# Altium schematic sheet Mjollnir.SchDoc (part 1 of 2)
size A0 portrait; SheetNumber: 1; SheetTotal: 1
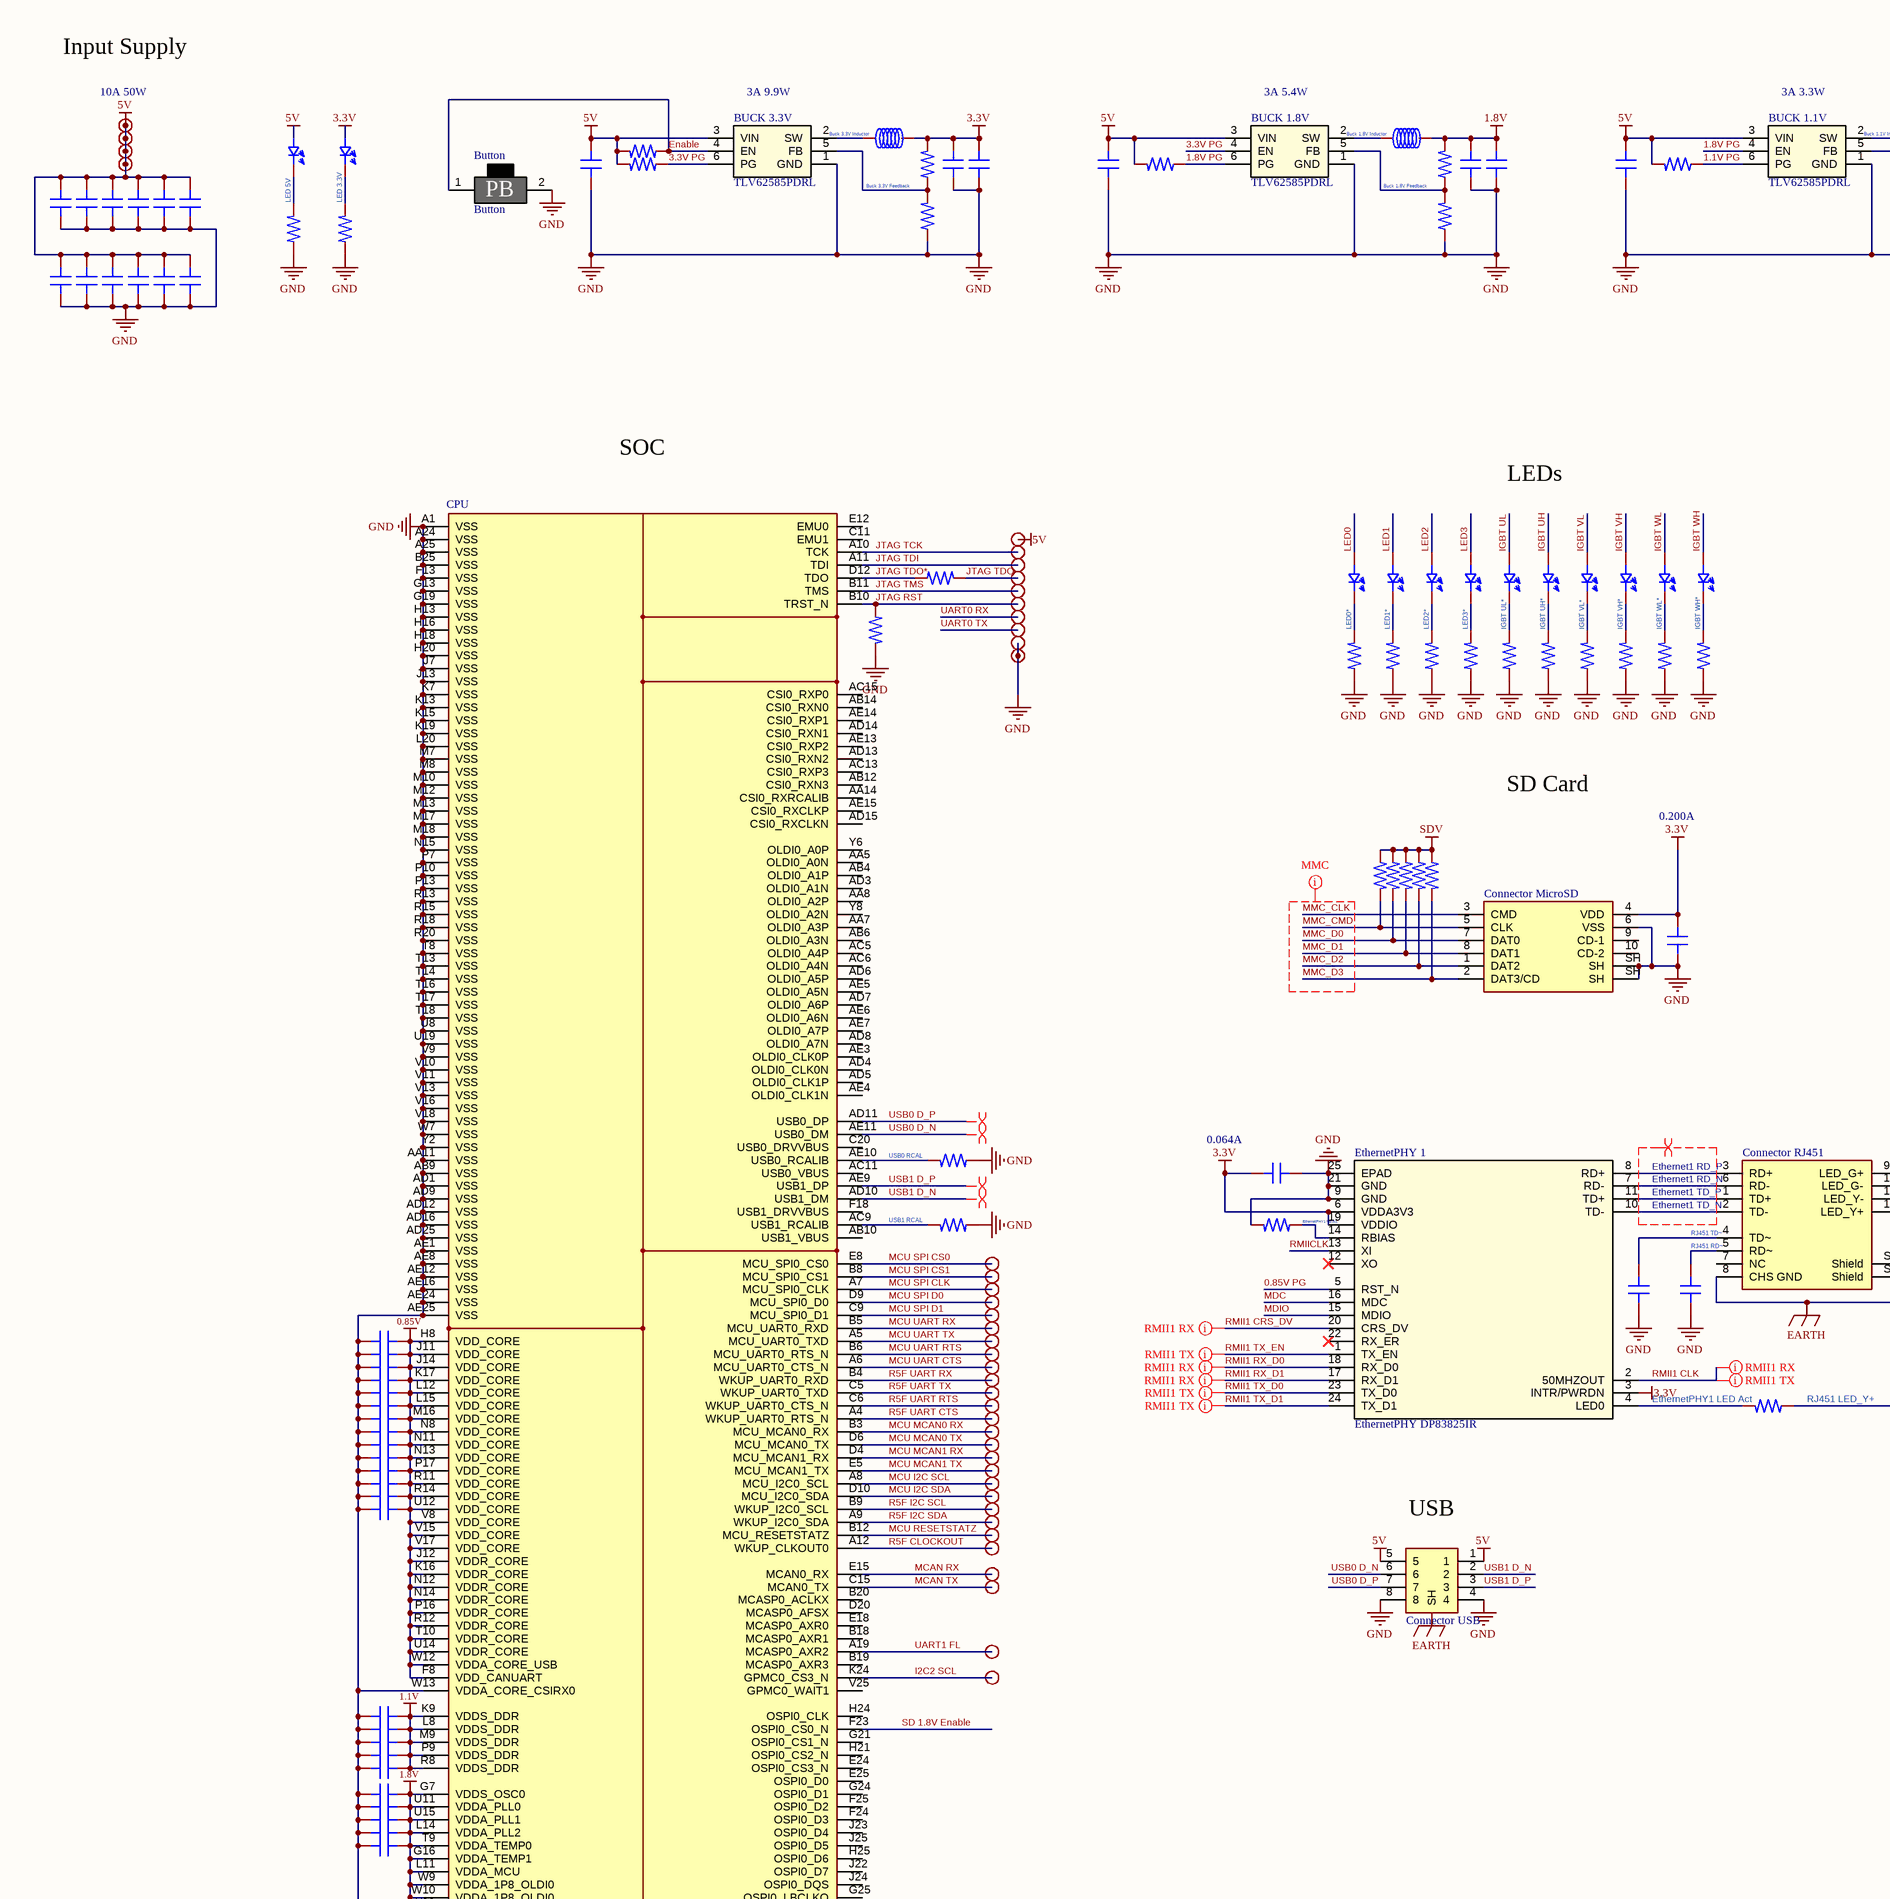
[diagram p0: Mjollnir.SchDoc, top left]
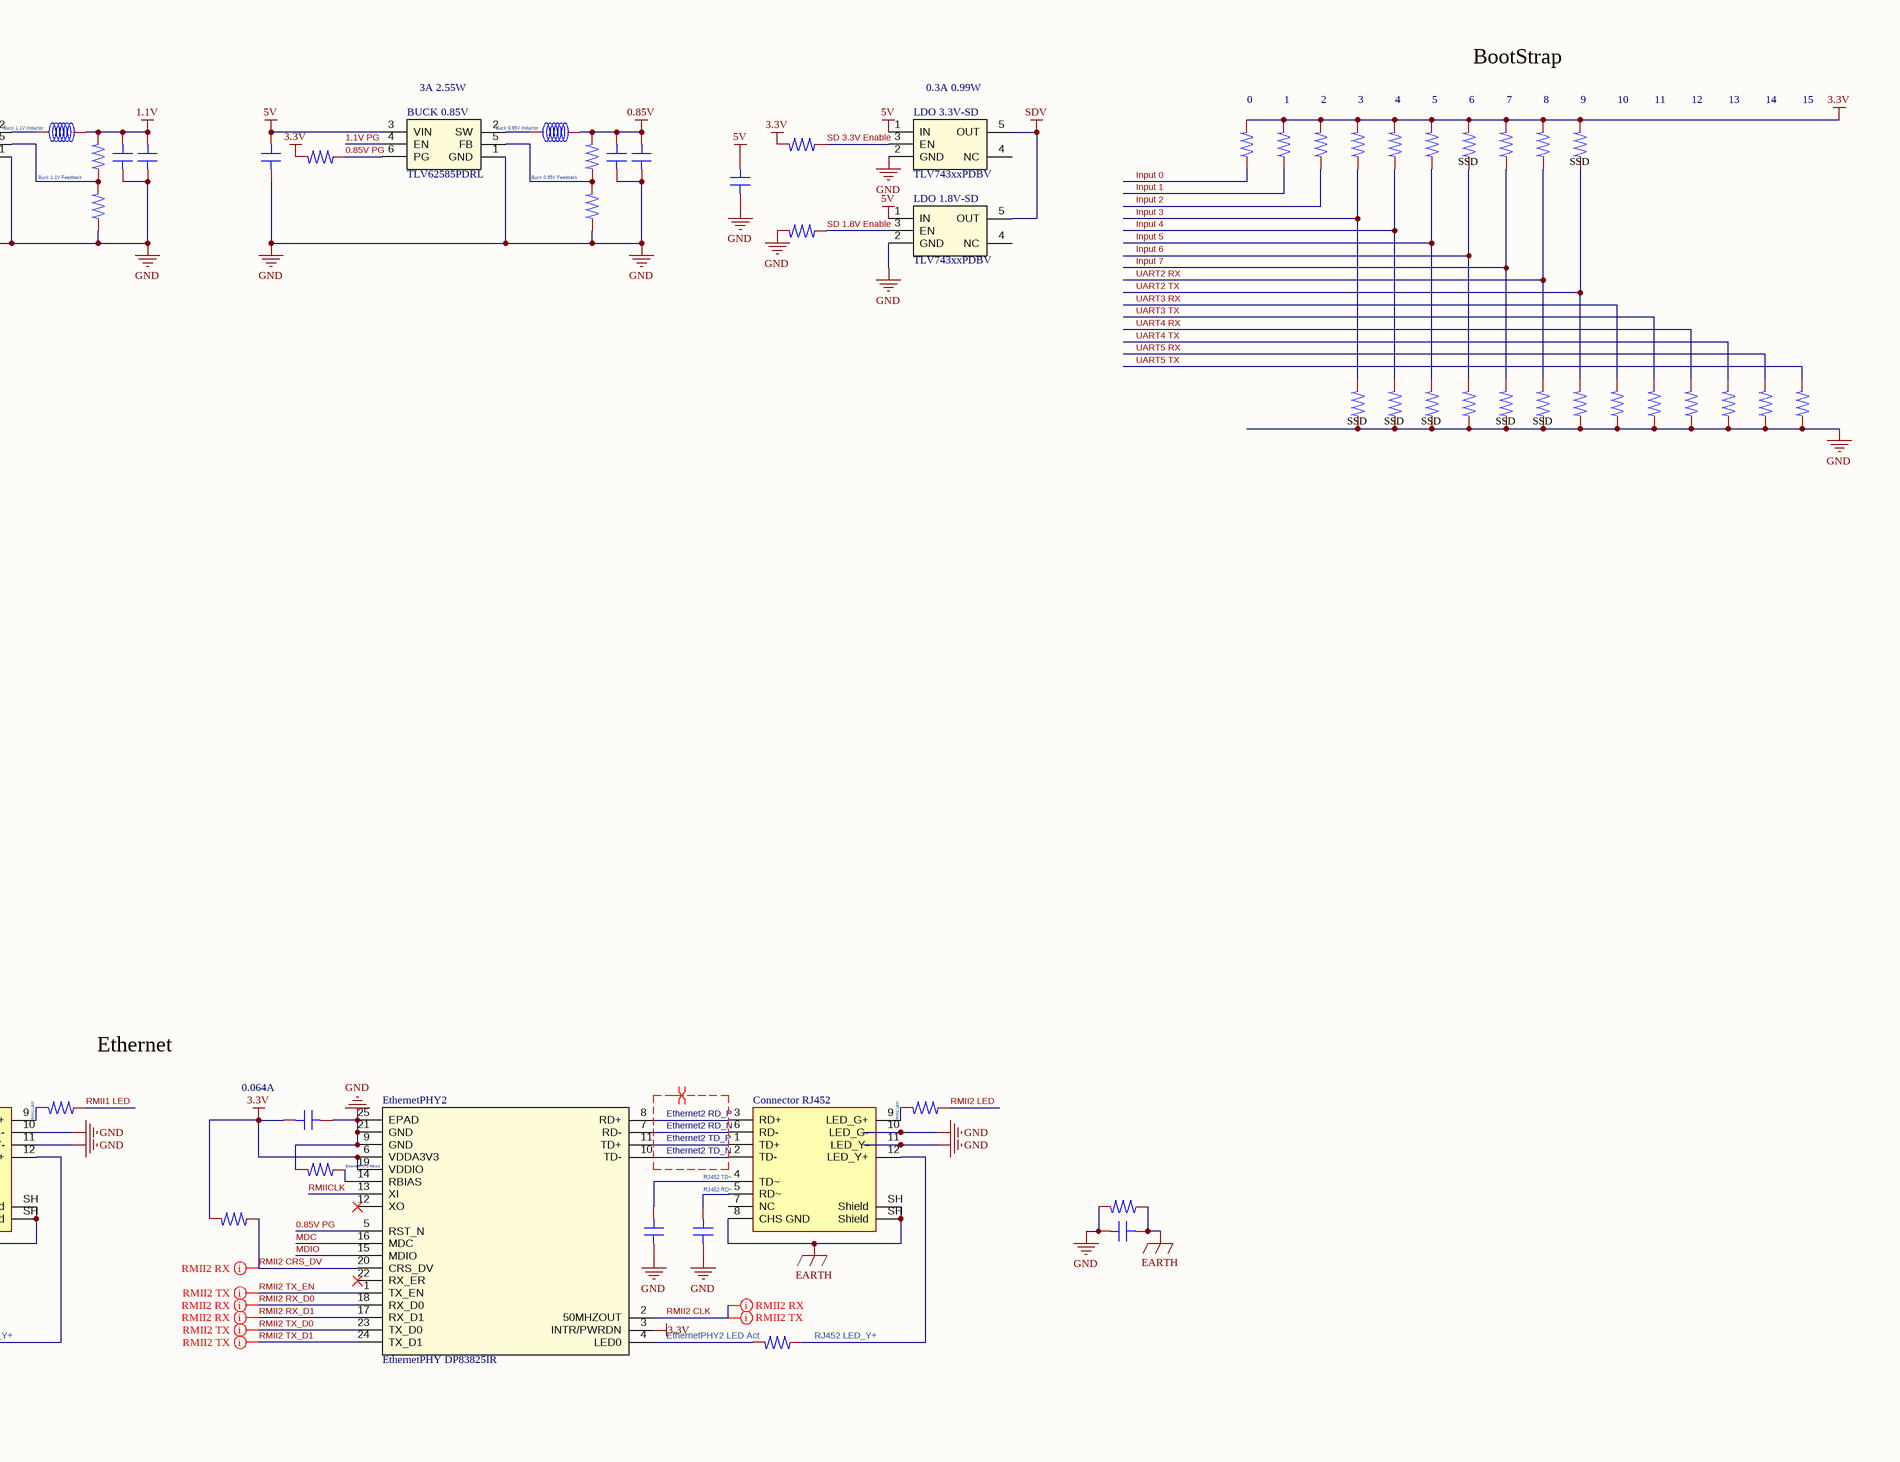
[diagram p1: Mjollnir.SchDoc, top right]
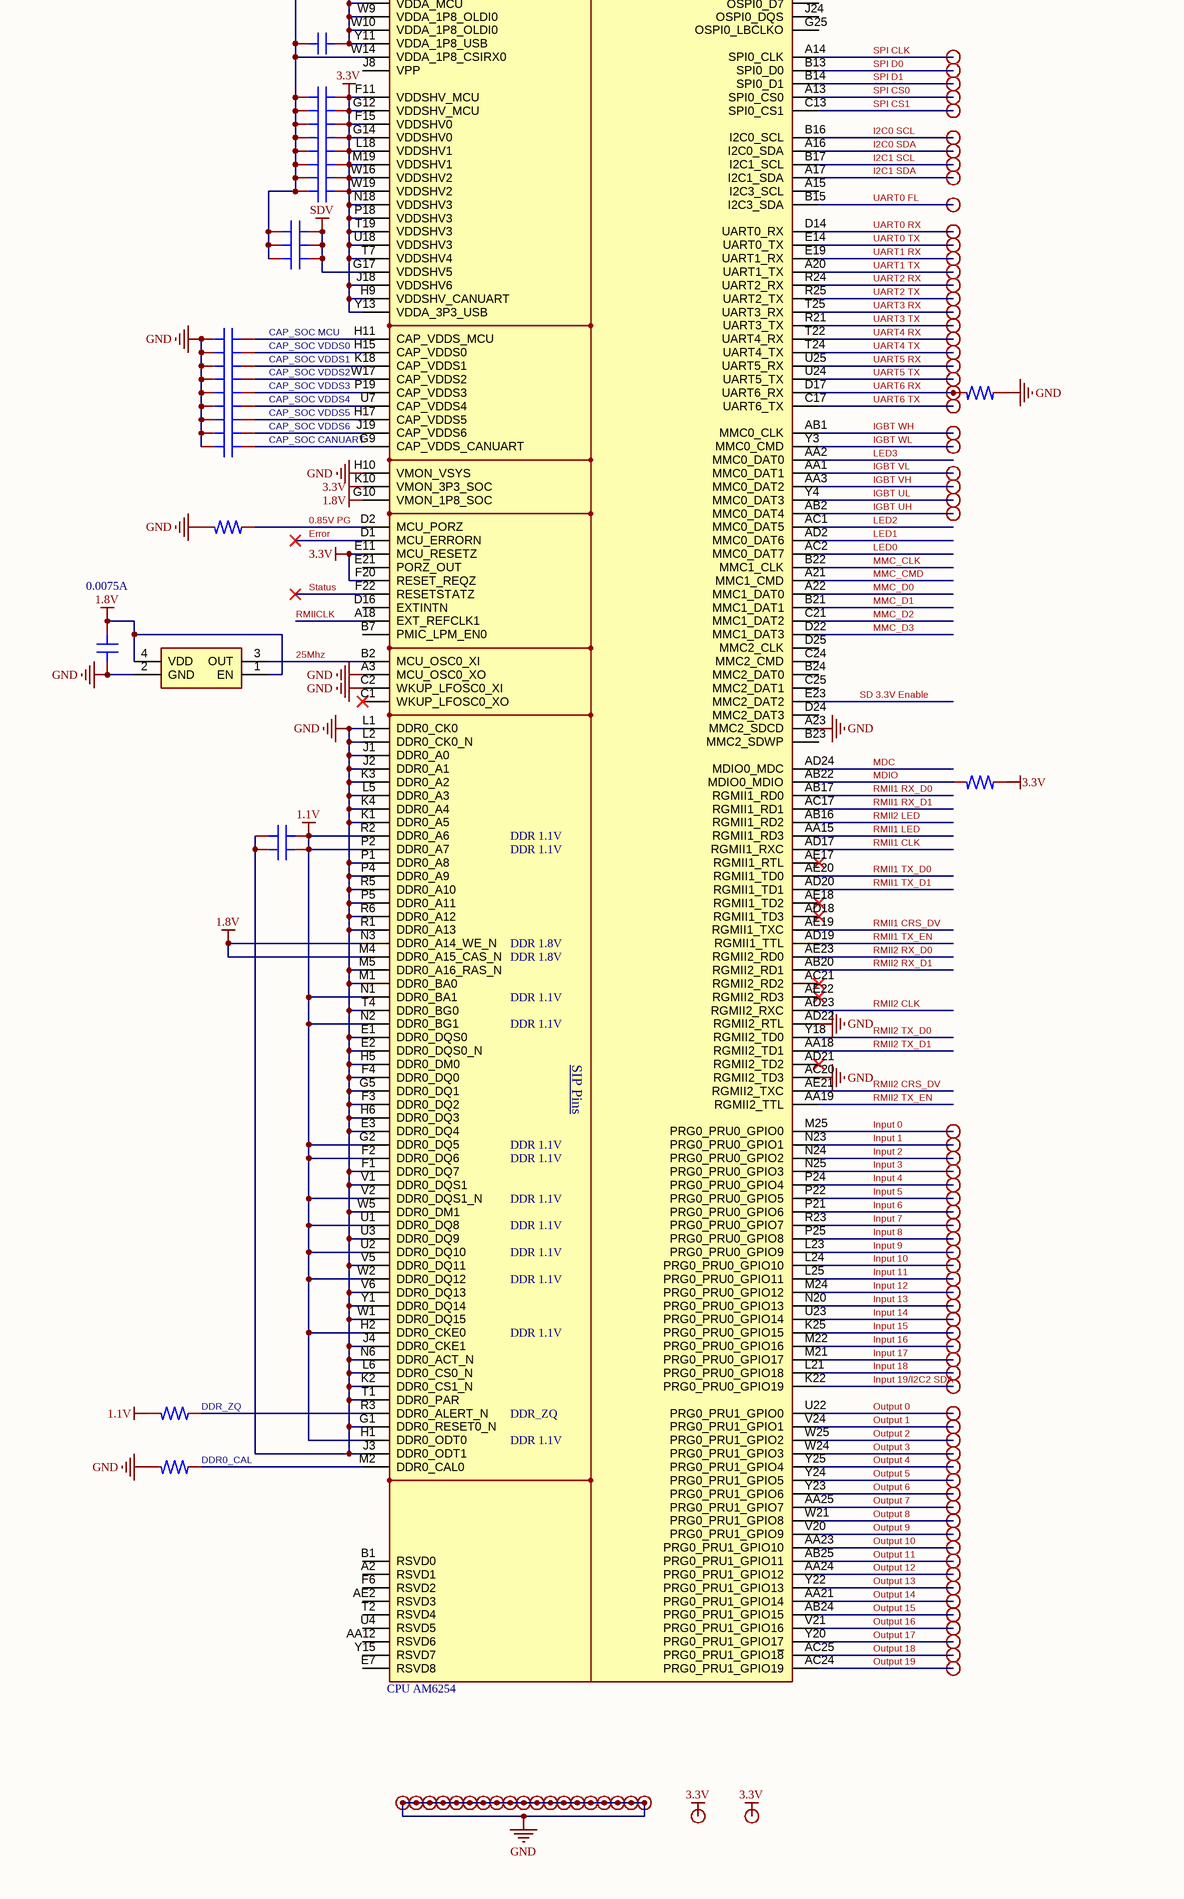
[diagram p2: Mjollnir.SchDoc, bottom left]

## Parts
BUCK_0.85V  TLV62585PDRL  [TPS62A03ADLR]
BUCK_1.1V  TLV62585PDRL  [TPS62A03ADLR]
BUCK_1.8V  TLV62585PDRL  [TPS62A03ADLR]
BUCK_3.3V  TLV62585PDRL  [TPS62A03ADLR]
Button  Button  [PushButton TSB008A25]
C_1.8V_Crystal  1uF  [Capacitor 2012(0805)]  (value not drawn)
C_AM62x_0.85V-1  0.1uF  [Capacitor 1005(0402)]  (value not drawn)
C_AM62x_0.85V-2  0.1uF  [Capacitor 1005(0402)]  (value not drawn)
C_AM62x_0.85V-3  0.1uF  [Capacitor 1005(0402)]  (value not drawn)
C_AM62x_0.85V-4  0.1uF  [Capacitor 1005(0402)]  (value not drawn)
C_AM62x_0.85V-5  0.1uF  [Capacitor 1005(0402)]  (value not drawn)
C_AM62x_0.85V-6  0.1uF  [Capacitor 1005(0402)]  (value not drawn)
C_AM62x_0.85V-7  0.1uF  [Capacitor 1005(0402)]  (value not drawn)
C_AM62x_0.85V-8  0.1uF  [Capacitor 1005(0402)]  (value not drawn)
C_AM62x_0.85V-9  0.1uF  [Capacitor 1005(0402)]  (value not drawn)
C_AM62x_0.85V-10  0.1uF  [Capacitor 1005(0402)]  (value not drawn)
C_AM62x_0.85V-11  0.1uF  [Capacitor 1005(0402)]  (value not drawn)
C_AM62x_0.85V-12  0.1uF  [Capacitor 1005(0402)]  (value not drawn)
C_AM62x_0.85V-13  0.1uF  [Capacitor 1005(0402)]  (value not drawn)
C_AM62x_0.85V-14  0.1uF  [Capacitor 1005(0402)]  (value not drawn)
C_AM62x_1.1V-1  0.1uF  [Capacitor 1005(0402)]  (value not drawn)
C_AM62x_1.1V-2  0.1uF  [Capacitor 1005(0402)]  (value not drawn)
C_AM62x_1.1V-3  0.1uF  [Capacitor 1005(0402)]  (value not drawn)
C_AM62x_1.1V-4  0.1uF  [Capacitor 1005(0402)]  (value not drawn)
C_AM62x_1.1V-5  0.1uF  [Capacitor 1005(0402)]  (value not drawn)
C_AM62x_1.1V-6  0.1uF  [Capacitor 1005(0402)]  (value not drawn)
C_AM62x_1.1V-7  0.1uF  [Capacitor 1005(0402)]  (value not drawn)
C_AM62x_1.8V-1  0.1uF  [Capacitor 1005(0402)]  (value not drawn)
C_AM62x_1.8V-2  0.1uF  [Capacitor 1005(0402)]  (value not drawn)
C_AM62x_1.8V-3  0.1uF  [Capacitor 1005(0402)]  (value not drawn)
C_AM62x_1.8V-4  0.1uF  [Capacitor 1005(0402)]  (value not drawn)
C_AM62x_1.8V-5  0.1uF  [Capacitor 1005(0402)]  (value not drawn)
C_AM62x_1.8V-10  0.1uF  [Capacitor 1005(0402)]  (value not drawn)
C_AM62x_3.3V-1  0.1uF  [Capacitor 1005(0402)]  (value not drawn)
C_AM62x_3.3V-2  0.1uF  [Capacitor 1005(0402)]  (value not drawn)
C_AM62x_3.3V-3  0.1uF  [Capacitor 1005(0402)]  (value not drawn)
C_AM62x_3.3V-4  0.1uF  [Capacitor 1005(0402)]  (value not drawn)
C_AM62x_3.3V-5  0.1uF  [Capacitor 1005(0402)]  (value not drawn)
C_AM62x_3.3V-6  0.1uF  [Capacitor 1005(0402)]  (value not drawn)
C_AM62x_3.3V-7  0.1uF  [Capacitor 1005(0402)]  (value not drawn)
C_AM62x_3.3V-8  0.1uF  [Capacitor 1005(0402)]  (value not drawn)
C_AM62x_SDV_0.1uF  0.1uF  [Capacitor 1005(0402)]  (value not drawn)
C_AM62x_SDV_1uF  1uF  [Capacitor 2012(0805)]  (value not drawn)
C_AM62x_SDV_10uF  10uF  [Capacitor 2012(0805)]  (value not drawn)
C_Backup-1  22uF  [Capacitor 2012(0805)]  (value not drawn)
C_Backup-2  22uF  [Capacitor 2012(0805)]  (value not drawn)
C_Backup-3  22uF  [Capacitor 2012(0805)]  (value not drawn)
C_Backup-4  22uF  [Capacitor 2012(0805)]  (value not drawn)
C_Backup-5  22uF  [Capacitor 2012(0805)]  (value not drawn)
C_Backup-6  22uF  [Capacitor 2012(0805)]  (value not drawn)
C_Backup-7  22uF  [Capacitor 2012(0805)]  (value not drawn)
C_Backup-8  22uF  [Capacitor 2012(0805)]  (value not drawn)
C_Backup-9  22uF  [Capacitor 2012(0805)]  (value not drawn)
C_Backup-10  22uF  [Capacitor 2012(0805)]  (value not drawn)
C_Backup-11  22uF  [Capacitor 2012(0805)]  (value not drawn)
C_Backup-12  22uF  [Capacitor 2012(0805)]  (value not drawn)
C_BUCK-0.85V-IN  22uF  [Capacitor 2012(0805)]  (value not drawn)
C_BUCK-0.85V-OUT1  22uF  [Capacitor 2012(0805)]  (value not drawn)
C_BUCK-0.85V-OUT2  22uF  [Capacitor 2012(0805)]  (value not drawn)
C_BUCK-1.1V-IN  22uF  [Capacitor 2012(0805)]  (value not drawn)
C_BUCK-1.1V-OUT1  22uF  [Capacitor 2012(0805)]  (value not drawn)
C_BUCK-1.1V-OUT2  22uF  [Capacitor 2012(0805)]  (value not drawn)
C_BUCK-1.8V-IN  22uF  [Capacitor 2012(0805)]  (value not drawn)
C_BUCK-1.8V-OUT1  22uF  [Capacitor 2012(0805)]  (value not drawn)
C_BUCK-1.8V-OUT2  22uF  [Capacitor 2012(0805)]  (value not drawn)
C_BUCK-3.3V-IN  22uF  [Capacitor 2012(0805)]  (value not drawn)
C_BUCK-3.3V-OUT1  22uF  [Capacitor 2012(0805)]  (value not drawn)
C_BUCK-3.3V-OUT2  22uF  [Capacitor 2012(0805)]  (value not drawn)
C_CAP_SOC_MCU  1uF  [Capacitor 1005(0402)]  (value not drawn)
C_CAP_SOC_VDDS0  1uF  [Capacitor 1005(0402)]  (value not drawn)
C_CAP_SOC_VDDS1  1uF  [Capacitor 1005(0402)]  (value not drawn)
C_CAP_SOC_VDDS2  1uF  [Capacitor 1005(0402)]  (value not drawn)
C_CAP_SOC_VDDS3  1uF  [Capacitor 1005(0402)]  (value not drawn)
C_CAP_SOC_VDDS4  1uF  [Capacitor 1005(0402)]  (value not drawn)
C_CAP_SOC_VDDS5  1uF  [Capacitor 1005(0402)]  (value not drawn)
C_CAP_SOC_VDDS6  1uF  [Capacitor 1005(0402)]  (value not drawn)
C_CAP_SOC_VDDS_CANUART  1uF  [Capacitor 1005(0402)]  (value not drawn)
C_EthernetPHY1-1  22uF  [Capacitor 2012(0805)]  (value not drawn)
C_EthernetPHY2-1  22uF  [Capacitor 2012(0805)]  (value not drawn)
C_EthernetPHY_Earth  0.1uF  [Capacitor 2012(0805)]  (value not drawn)
C_LDO_SDV-IN  0.1uF  [Capacitor 2012(0805)]  (value not drawn)
C_MMC-1  0.1uF  [Capacitor 2012(0805)]  (value not drawn)
C_RJ451_RD1  1uF  [Capacitor 2012(0805)]  (value not drawn)
C_RJ451_TD1  1uF  [Capacitor 2012(0805)]  (value not drawn)
C_RJ452_RD1  1uF  [Capacitor 2012(0805)]  (value not drawn)
C_RJ452_TD1  1uF  [Capacitor 2012(0805)]  (value not drawn)
Connector_3.3V_Aux-1  Connector BergStrip  [BergStrip 2.54mm]  (value not drawn)
Connector_3.3V_Aux-2  Connector BergStrip  [BergStrip 2.54mm]  (value not drawn)
Connector_5V-1  Connector BergStrip  [BergStrip 2.54mm]  (value not drawn)
Connector_5V-2  Connector BergStrip  [BergStrip 2.54mm]  (value not drawn)
Connector_5V-3  Connector BergStrip  [BergStrip 2.54mm]  (value not drawn)
Connector_5V-4  Connector BergStrip  [BergStrip 2.54mm]  (value not drawn)
Connector_GND1  Connector BergStrip  [BergStrip 2.54mm]  (value not drawn)
Connector_GND2  Connector BergStrip  [BergStrip 2.54mm]  (value not drawn)
Connector_GND3  Connector BergStrip  [BergStrip 2.54mm]  (value not drawn)
Connector_GND4  Connector BergStrip  [BergStrip 2.54mm]  (value not drawn)
Connector_GND5  Connector BergStrip  [BergStrip 2.54mm]  (value not drawn)
Connector_GND6  Connector BergStrip  [BergStrip 2.54mm]  (value not drawn)
Connector_GND7  Connector BergStrip  [BergStrip 2.54mm]  (value not drawn)
Connector_GND8  Connector BergStrip  [BergStrip 2.54mm]  (value not drawn)
Connector_GND9  Connector BergStrip  [BergStrip 2.54mm]  (value not drawn)
Connector_GND11  Connector BergStrip  [BergStrip 2.54mm]  (value not drawn)
Connector_GND12  Connector BergStrip  [BergStrip 2.54mm]  (value not drawn)
Connector_GND13  Connector BergStrip  [BergStrip 2.54mm]  (value not drawn)
Connector_GND14  Connector BergStrip  [BergStrip 2.54mm]  (value not drawn)
Connector_GND15  Connector BergStrip  [BergStrip 2.54mm]  (value not drawn)
Connector_GND16  Connector BergStrip  [BergStrip 2.54mm]  (value not drawn)
Connector_GND17  Connector BergStrip  [BergStrip 2.54mm]  (value not drawn)
Connector_GND18  Connector BergStrip  [BergStrip 2.54mm]  (value not drawn)
Connector_GND19  Connector BergStrip  [BergStrip 2.54mm]  (value not drawn)
Connector_GND20  Connector BergStrip  [BergStrip 2.54mm]  (value not drawn)
Connector_I2C0_SCL  Connector BergStrip  [BergStrip 2.54mm]  (value not drawn)
Connector_I2C0_SDA  Connector BergStrip  [BergStrip 2.54mm]  (value not drawn)
Connector_I2C1_SCL  Connector BergStrip  [BergStrip 2.54mm]  (value not drawn)
Connector_I2C1_SDA  Connector BergStrip  [BergStrip 2.54mm]  (value not drawn)
Connector_I2C2_SDA  Connector BergStrip  [BergStrip 2.54mm]  (value not drawn)
Connector_IGBT_UH  Connector BergStrip  [BergStrip 2.54mm]  (value not drawn)
Connector_IGBT_UL  Connector BergStrip  [BergStrip 2.54mm]  (value not drawn)
Connector_IGBT_VH  Connector BergStrip  [BergStrip 2.54mm]  (value not drawn)
Connector_IGBT_VL  Connector BergStrip  [BergStrip 2.54mm]  (value not drawn)
Connector_IGBT_WH  Connector BergStrip  [BergStrip 2.54mm]  (value not drawn)
Connector_IGBT_WL  Connector BergStrip  [BergStrip 2.54mm]  (value not drawn)
Connector_JTAG_5V  Connector BergStrip  [BergStrip 2.54mm]  (value not drawn)
Connector_JTAG_GND-1  Connector BergStrip  [BergStrip 2.54mm]  (value not drawn)
Connector_JTAG_GND-2  Connector BergStrip  [BergStrip 2.54mm]  (value not drawn)
Connector_JTAG_RST  Connector BergStrip  [BergStrip 2.54mm]  (value not drawn)
Connector_JTAG_TCK  Connector BergStrip  [BergStrip 2.54mm]  (value not drawn)
Connector_JTAG_TDI  Connector BergStrip  [BergStrip 2.54mm]  (value not drawn)
Connector_JTAG_TDO  Connector BergStrip  [BergStrip 2.54mm]  (value not drawn)
Connector_JTAG_TMS  Connector BergStrip  [BergStrip 2.54mm]  (value not drawn)
Connector_JTAG_TX  Connector BergStrip  [BergStrip 2.54mm]  (value not drawn)
Connector_JTAG_UART_RX  Connector BergStrip  [BergStrip 2.54mm]  (value not drawn)
Connector_MCAN_RX  Connector BergStrip  [BergStrip 2.54mm]  (value not drawn)
Connector_MCAN_TX  Connector BergStrip  [BergStrip 2.54mm]  (value not drawn)
Connector_MCU_I2C_SCL  Connector BergStrip  [BergStrip 2.54mm]  (value not drawn)
Connector_MCU_I2C_SDA  Connector BergStrip  [BergStrip 2.54mm]  (value not drawn)
Connector_MCU_MCAN0_RX  Connector BergStrip  [BergStrip 2.54mm]  (value not drawn)
Connector_MCU_MCAN0_TX  Connector BergStrip  [BergStrip 2.54mm]  (value not drawn)
Connector_MCU_MCAN1_RX  Connector BergStrip  [BergStrip 2.54mm]  (value not drawn)
Connector_MCU_MCAN1_TX  Connector BergStrip  [BergStrip 2.54mm]  (value not drawn)
Connector_MCU_RESETSTATZ  Connector BergStrip  [BergStrip 2.54mm]  (value not drawn)
Connector_MCU_SPI_CLK  Connector BergStrip  [BergStrip 2.54mm]  (value not drawn)
Connector_MCU_SPI_CS0  Connector BergStrip  [BergStrip 2.54mm]  (value not drawn)
Connector_MCU_SPI_CS1  Connector BergStrip  [BergStrip 2.54mm]  (value not drawn)
Connector_MCU_SPI_D0  Connector BergStrip  [BergStrip 2.54mm]  (value not drawn)
Connector_MCU_SPI_D1  Connector BergStrip  [BergStrip 2.54mm]  (value not drawn)
Connector_MCU_UART_CTS  Connector BergStrip  [BergStrip 2.54mm]  (value not drawn)
Connector_MCU_UART_RTS  Connector BergStrip  [BergStrip 2.54mm]  (value not drawn)
Connector_MCU_UART_RX  Connector BergStrip  [BergStrip 2.54mm]  (value not drawn)
Connector_MCU_UART_TX  Connector BergStrip  [BergStrip 2.54mm]  (value not drawn)
Connector_MicroSD  Connector MicroSD  [MicroSD SameSky MSD-11-A]  (value not drawn)
Connector_PRU0_GPIO0  Connector BergStrip  [BergStrip 2.54mm]  (value not drawn)
Connector_PRU0_GPIO1  Connector BergStrip  [BergStrip 2.54mm]  (value not drawn)
Connector_PRU0_GPIO2  Connector BergStrip  [BergStrip 2.54mm]  (value not drawn)
Connector_PRU0_GPIO3  Connector BergStrip  [BergStrip 2.54mm]  (value not drawn)
Connector_PRU0_GPIO4  Connector BergStrip  [BergStrip 2.54mm]  (value not drawn)
Connector_PRU0_GPIO5  Connector BergStrip  [BergStrip 2.54mm]  (value not drawn)
Connector_PRU0_GPIO6  Connector BergStrip  [BergStrip 2.54mm]  (value not drawn)
Connector_PRU0_GPIO7  Connector BergStrip  [BergStrip 2.54mm]  (value not drawn)
Connector_PRU0_GPIO8  Connector BergStrip  [BergStrip 2.54mm]  (value not drawn)
Connector_PRU0_GPIO9  Connector BergStrip  [BergStrip 2.54mm]  (value not drawn)
Connector_PRU0_GPIO10  Connector BergStrip  [BergStrip 2.54mm]  (value not drawn)
Connector_PRU0_GPIO11  Connector BergStrip  [BergStrip 2.54mm]  (value not drawn)
Connector_PRU0_GPIO12  Connector BergStrip  [BergStrip 2.54mm]  (value not drawn)
Connector_PRU0_GPIO13  Connector BergStrip  [BergStrip 2.54mm]  (value not drawn)
Connector_PRU0_GPIO14  Connector BergStrip  [BergStrip 2.54mm]  (value not drawn)
Connector_PRU0_GPIO15  Connector BergStrip  [BergStrip 2.54mm]  (value not drawn)
Connector_PRU0_GPIO16  Connector BergStrip  [BergStrip 2.54mm]  (value not drawn)
Connector_PRU0_GPIO17  Connector BergStrip  [BergStrip 2.54mm]  (value not drawn)
Connector_PRU0_GPIO18  Connector BergStrip  [BergStrip 2.54mm]  (value not drawn)
Connector_PRU0_GPIO19  Connector BergStrip  [BergStrip 2.54mm]  (value not drawn)
Connector_PRU1_GPIO0  Connector BergStrip  [BergStrip 2.54mm]  (value not drawn)
Connector_PRU1_GPIO1  Connector BergStrip  [BergStrip 2.54mm]  (value not drawn)
Connector_PRU1_GPIO2  Connector BergStrip  [BergStrip 2.54mm]  (value not drawn)
Connector_PRU1_GPIO3  Connector BergStrip  [BergStrip 2.54mm]  (value not drawn)
Connector_PRU1_GPIO4  Connector BergStrip  [BergStrip 2.54mm]  (value not drawn)
Connector_PRU1_GPIO5  Connector BergStrip  [BergStrip 2.54mm]  (value not drawn)
Connector_PRU1_GPIO6  Connector BergStrip  [BergStrip 2.54mm]  (value not drawn)
Connector_PRU1_GPIO7  Connector BergStrip  [BergStrip 2.54mm]  (value not drawn)
Connector_PRU1_GPIO8  Connector BergStrip  [BergStrip 2.54mm]  (value not drawn)
Connector_PRU1_GPIO9  Connector BergStrip  [BergStrip 2.54mm]  (value not drawn)
Connector_PRU1_GPIO10  Connector BergStrip  [BergStrip 2.54mm]  (value not drawn)
Connector_PRU1_GPIO11  Connector BergStrip  [BergStrip 2.54mm]  (value not drawn)
Connector_PRU1_GPIO12  Connector BergStrip  [BergStrip 2.54mm]  (value not drawn)
Connector_PRU1_GPIO13  Connector BergStrip  [BergStrip 2.54mm]  (value not drawn)
Connector_PRU1_GPIO14  Connector BergStrip  [BergStrip 2.54mm]  (value not drawn)
Connector_PRU1_GPIO15  Connector BergStrip  [BergStrip 2.54mm]  (value not drawn)
Connector_PRU1_GPIO16  Connector BergStrip  [BergStrip 2.54mm]  (value not drawn)
Connector_PRU1_GPIO17  Connector BergStrip  [BergStrip 2.54mm]  (value not drawn)
Connector_PRU1_GPIO18  Connector BergStrip  [BergStrip 2.54mm]  (value not drawn)
Connector_PRU1_GPIO19  Connector BergStrip  [BergStrip 2.54mm]  (value not drawn)
Connector_R5F_CLOCKOUT  Connector BergStrip  [BergStrip 2.54mm]  (value not drawn)
Connector_R5F_I2C_SCL  Connector BergStrip  [BergStrip 2.54mm]  (value not drawn)
Connector_R5F_I2C_SDA  Connector BergStrip  [BergStrip 2.54mm]  (value not drawn)
Connector_R5F_UART_CTS  Connector BergStrip  [BergStrip 2.54mm]  (value not drawn)
Connector_R5F_UART_RTS  Connector BergStrip  [BergStrip 2.54mm]  (value not drawn)
Connector_R5F_UART_RX  Connector BergStrip  [BergStrip 2.54mm]  (value not drawn)
Connector_R5F_UART_TX  Connector BergStrip  [BergStrip 2.54mm]  (value not drawn)
Connector_RJ451  Connector HR911105A  [RJ45 HR911105A]  (value not drawn)
Connector_RJ452  Connector HR911105A  [RJ45 HR911105A]  (value not drawn)
Connector_SPI_CS0  Connector BergStrip  [BergStrip 2.54mm]  (value not drawn)
Connector_SPI_CS1  Connector BergStrip  [BergStrip 2.54mm]  (value not drawn)
Connector_SPI_D0  Connector BergStrip  [BergStrip 2.54mm]  (value not drawn)
Connector_SPI_D1  Connector BergStrip  [BergStrip 2.54mm]  (value not drawn)
Connector_SPL_CLK  Connector BergStrip  [BergStrip 2.54mm]  (value not drawn)
Connector_UART0_FL  Connector BergStrip  [BergStrip 2.54mm]  (value not drawn)
Connector_UART0_RX  Connector BergStrip  [BergStrip 2.54mm]  (value not drawn)
Connector_UART0_TX  Connector BergStrip  [BergStrip 2.54mm]  (value not drawn)
Connector_UART1_FL  Connector BergStrip  [BergStrip 2.54mm]  (value not drawn)
Connector_UART1_RX  Connector BergStrip  [BergStrip 2.54mm]  (value not drawn)
Connector_UART1_TX  Connector BergStrip  [BergStrip 2.54mm]  (value not drawn)
Connector_UART2_RX  Connector BergStrip  [BergStrip 2.54mm]  (value not drawn)
Connector_UART2_TX  Connector BergStrip  [BergStrip 2.54mm]  (value not drawn)
Connector_UART3_RX  Connector BergStrip  [BergStrip 2.54mm]  (value not drawn)
Connector_UART3_TX  Connector BergStrip  [BergStrip 2.54mm]  (value not drawn)
Connector_UART4_RX  Connector BergStrip  [BergStrip 2.54mm]  (value not drawn)
Connector_UART4_TX  Connector BergStrip  [BergStrip 2.54mm]  (value not drawn)
Connector_UART5_RX  Connector BergStrip  [BergStrip 2.54mm]  (value not drawn)
Connector_UART5_TX  Connector BergStrip  [BergStrip 2.54mm]  (value not drawn)
Connector_UART6_RX  Connector BergStrip  [BergStrip 2.54mm]  (value not drawn)
Connector_UART6_TX  Connector BergStrip  [BergStrip 2.54mm]  (value not drawn)
Connector_USB  Connector USB-A 2 Row  [Connector USB-A 2 Row]  (value not drawn)
CPU  CPU AM6254  [AM6254]
EthernetPHY2  EthernetPHY DP83825IR  [DP83825IRMQR]
EthernetPHY_1  EthernetPHY DP83825IR  [DP83825IRMQR]
L_Buck_0.85V  1uH 3.1A  [Inductor 2016(0806)]  (value not drawn)
L_Buck_1.1V  1uH 3.1A  [Inductor 2016(0806)]  (value not drawn)
L_Buck_1.8V  1uH 3.1A  [Inductor 2016(0806)]  (value not drawn)
L_Buck_3.3V  1uH 3.1A  [Inductor 2016(0806)]  (value not drawn)
LDO_1.8V-SD  TLV743xxPDBV  [TLV743xxPDBV]
LDO_3.3V-SD  TLV743xxPDBV  [TLV743xxPDBV]
LED0  Red  [LED 2012(0805)]  (value not drawn)
LED1  Red  [LED 2012(0805)]  (value not drawn)
LED2  Red  [LED 2012(0805)]  (value not drawn)
LED3  Red  [LED 2012(0805)]  (value not drawn)
LED_3.3V  Red  [LED 2012(0805)]  (value not drawn)
LED_5V  Red  [LED 2012(0805)]  (value not drawn)
LED_IGBT_UH  Red  [LED 2012(0805)]  (value not drawn)
LED_IGBT_UL  Red  [LED 2012(0805)]  (value not drawn)
LED_IGBT_VH  Red  [LED 2012(0805)]  (value not drawn)
LED_IGBT_VL  Red  [LED 2012(0805)]  (value not drawn)
LED_IGBT_WH  Red  [LED 2012(0805)]  (value not drawn)
LED_IGBT_WL  Red  [LED 2012(0805)]  (value not drawn)
MDIO_Pullup  1.5K  [Resistor 2012(0805)]  (value not drawn)
MMC_SDCD_Pulldown  1.5K  [Resistor 1005(0402)]  (value not drawn)
R_BootStrap_Down_3  100K  [Resistor 1005(0402)]  (value not drawn)
R_BootStrap_Down_4  100K  [Resistor 1005(0402)]  (value not drawn)
R_BootStrap_Down_5  100K  [Resistor 1005(0402)]  (value not drawn)
R_BootStrap_Down_6  1.1K  [Resistor 1005(0402)]  (value not drawn)
R_BootStrap_Down_7  100K  [Resistor 1005(0402)]  (value not drawn)
R_BootStrap_Down_8  100K  [Resistor 1005(0402)]  (value not drawn)
R_BootStrap_Down_9  1.1K  [Resistor 1005(0402)]  (value not drawn)
R_BootStrap_Down_10  100K  [Resistor 1005(0402)]  (value not drawn)
R_BootStrap_Down_11  100K  [Resistor 1005(0402)]  (value not drawn)
R_BootStrap_Down_12  100K  [Resistor 1005(0402)]  (value not drawn)
R_BootStrap_Down_13  100K  [Resistor 1005(0402)]  (value not drawn)
R_BootStrap_Down_14  100K  [Resistor 1005(0402)]  (value not drawn)
R_BootStrap_Down_15  100K  [Resistor 1005(0402)]  (value not drawn)
R_BootStrap_Up_0  1.1K  [Resistor 1005(0402)]  (value not drawn)
R_BootStrap_Up_1  1.1K  [Resistor 1005(0402)]  (value not drawn)
R_BootStrap_Up_2  100K  [Resistor 1005(0402)]  (value not drawn)
R_BootStrap_Up_3  100K  [Resistor 1005(0402)]  (value not drawn)
R_BootStrap_Up_4  100K  [Resistor 1005(0402)]  (value not drawn)
R_BootStrap_Up_5  100K  [Resistor 1005(0402)]  (value not drawn)
R_BootStrap_Up_6  1.1K  [Resistor 1005(0402)]  (value not drawn)
R_BootStrap_Up_7  100K  [Resistor 1005(0402)]  (value not drawn)
R_BootStrap_Up_8  100K  [Resistor 1005(0402)]  (value not drawn)
R_BootStrap_Up_9  1.1K  [Resistor 1005(0402)]  (value not drawn)
R_BUCK-0.85V_Divider-H  4.53K  [Resistor 2012(0805)]  (value not drawn)
R_BUCK-0.85V_Divider-L  1K  [Resistor 2012(0805)]  (value not drawn)
R_BUCK-0.85V_PG  1K  [Resistor 2012(0805)]  (value not drawn)
R_BUCK-1.1V_Divider-H  4.53K  [Resistor 2012(0805)]  (value not drawn)
R_BUCK-1.1V_Divider-L  1K  [Resistor 2012(0805)]  (value not drawn)
R_BUCK-1.1V_PG  1K  [Resistor 2012(0805)]  (value not drawn)
R_BUCK-1.8V_Divider-H  4.53K  [Resistor 2012(0805)]  (value not drawn)
R_BUCK-1.8V_Divider-L  1K  [Resistor 2012(0805)]  (value not drawn)
R_BUCK-1.8V_PG  1K  [Resistor 2012(0805)]  (value not drawn)
R_BUCK-3.3V_Divider-H  4.53K  [Resistor 2012(0805)]  (value not drawn)
R_BUCK-3.3V_Divider-L  1K  [Resistor 2012(0805)]  (value not drawn)
R_BUCK-3.3V_EN  1K  [Resistor 2012(0805)]  (value not drawn)
R_BUCK-3.3V_PG  1K  [Resistor 2012(0805)]  (value not drawn)
R_DDR0_CAL0  240E 1%  [Resistor 1005(0402)]  (value not drawn)
R_DDRZQ  240E 1%  [Resistor 1005(0402)]  (value not drawn)
R_EthernetPHY1_LED_Act  6.49K 1%  [Resistor 2012(0805)]  (value not drawn)
R_EthernetPHY1_LED_USER  6.49K 1%  [Resistor 2012(0805)]  (value not drawn)
R_EthernetPHY2_LED_Act  6.49K 1%  [Resistor 2012(0805)]  (value not drawn)
R_EthernetPHY2_LED_USER  6.49K 1%  [Resistor 2012(0805)]  (value not drawn)
R_EthernetPHY_Earth  6.49K 1%  [Resistor 2012(0805)]  (value not drawn)
R_JTAG_Pulldown_RST  4.7K  [Resistor 1005(0402)]  (value not drawn)
R_JTAG_TDO  22E  [Resistor 2012(0805)]  (value not drawn)
R_LDO-1.8V-SD_Pulldown  1K  [Resistor 2012(0805)]  (value not drawn)
R_LDO-3.3V-SD_Pullup  1K  [Resistor 2012(0805)]  (value not drawn)
R_LED0  150E  [Resistor 2012(0805)]  (value not drawn)
R_LED1  150E  [Resistor 2012(0805)]  (value not drawn)
R_LED2  150E  [Resistor 2012(0805)]  (value not drawn)
R_LED3  150E  [Resistor 2012(0805)]  (value not drawn)
R_LED_3.3V  150E  [Resistor 2012(0805)]  (value not drawn)
R_LED_5V  150E  [Resistor 2012(0805)]  (value not drawn)
R_LED_IGBT_UH  150E  [Resistor 2012(0805)]  (value not drawn)
R_LED_IGBT_UL  150E  [Resistor 2012(0805)]  (value not drawn)
R_LED_IGBT_VH  150E  [Resistor 2012(0805)]  (value not drawn)
R_LED_IGBT_VL  150E  [Resistor 2012(0805)]  (value not drawn)
R_LED_IGBT_WH  150E  [Resistor 2012(0805)]  (value not drawn)
R_LED_IGBT_WL  150E  [Resistor 2012(0805)]  (value not drawn)
R_MCU_PORZ  10K  [Resistor 2012(0805)]  (value not drawn)
R_MMC_PULLUP_CMD  10K  [Resistor 2012(0805)]  (value not drawn)
R_MMC_PULLUP_D0  10K  [Resistor 2012(0805)]  (value not drawn)
R_MMC_PULLUP_D1  10K  [Resistor 2012(0805)]  (value not drawn)
R_MMC_PULLUP_D2  10K  [Resistor 2012(0805)]  (value not drawn)
R_MMC_PULLUP_D3  10K  [Resistor 2012(0805)]  (value not drawn)
R_RBIAS_EthernetPHY1  6.49K 1%  [Resistor 2012(0805)]  (value not drawn)
R_RBIAS_EthernetPHY2  6.49K 1%  [Resistor 2012(0805)]  (value not drawn)
R_USB0_CAL  240E 1%  [Resistor 1005(0402)]  (value not drawn)
R_USB1_CAL  240E 1%  [Resistor 1005(0402)]  (value not drawn)
RMII2_Strap_Address_1  2.49K  [Resistor 2012(0805)]  (value not drawn)
X_25Mz_AM62x  Crystal CMOS  [CDC6CE025000ADLER]  (value not drawn)

## Nets
0.85V: C_AM62x_0.85V-1.2 C_AM62x_0.85V-2.2 C_AM62x_0.85V-3.2 C_AM62x_0.85V-4.2 C_AM62x_0.85V-5.2 C_AM62x_0.85V-6.2 C_AM62x_0.85V-7.2 C_AM62x_0.85V-8.2 C_AM62x_0.85V-9.2 C_AM62x_0.85V-10.2 C_AM62x_0.85V-11.2 C_AM62x_0.85V-12.2 C_AM62x_0.85V-13.2 C_AM62x_0.85V-14.2 C_BUCK-0.85V-OUT1.2 C_BUCK-0.85V-OUT2.2 CPU.F8(VDD_CANUART) CPU.H8(VDD_CORE) CPU.J11(VDD_CORE) CPU.J12(VDDR_CORE) CPU.J14(VDD_CORE) CPU.K16(VDDR_CORE) CPU.K17(VDD_CORE) CPU.L12(VDD_CORE) CPU.L15(VDD_CORE) CPU.M16(VDD_CORE) CPU.N8(VDD_CORE) CPU.N11(VDD_CORE) CPU.N12(VDDR_CORE) CPU.N13(VDD_CORE) CPU.N14(VDDR_CORE) CPU.P16(VDDR_CORE) CPU.P17(VDD_CORE) CPU.R11(VDD_CORE) CPU.R12(VDDR_CORE) CPU.R14(VDD_CORE) CPU.T10(VDDR_CORE) CPU.U12(VDD_CORE) CPU.U14(VDDR_CORE) CPU.V8(VDD_CORE) CPU.V15(VDD_CORE) CPU.V17(VDD_CORE) CPU.W12(VDDA_CORE_USB) L_Buck_0.85V.2 R_BUCK-0.85V_Divider-H.2
1.1V: C_AM62x_1.1V-1.2 C_AM62x_1.1V-2.2 C_AM62x_1.1V-3.2 C_AM62x_1.1V-4.2 C_AM62x_1.1V-5.2 C_AM62x_1.1V-6.2 C_AM62x_1.1V-7.2 C_BUCK-1.1V-OUT1.2 C_BUCK-1.1V-OUT2.2 CPU.F2(DDR0_DQ6) CPU.G2(DDR0_DQ5) CPU.H1(DDR0_ODT0) CPU.H2(DDR0_CKE0) CPU.K9(VDDS_DDR) CPU.L8(VDDS_DDR) CPU.M9(VDDS_DDR) CPU.N1(DDR0_BA1) CPU.N2(DDR0_BG1) CPU.P2(DDR0_A7) CPU.P9(VDDS_DDR) CPU.R2(DDR0_A6) CPU.R8(VDDS_DDR) CPU.U1(DDR0_DQ8) CPU.U2(DDR0_DQ10) CPU.V2(DDR0_DQS1_N) CPU.W2(DDR0_DQ12) L_Buck_1.1V.2 R_BUCK-1.1V_Divider-H.2 R_DDRZQ.2
1.8V: C_1.8V_Crystal.2 C_AM62x_1.8V-1.2 C_AM62x_1.8V-2.2 C_AM62x_1.8V-3.2 C_AM62x_1.8V-4.2 C_AM62x_1.8V-5.2 C_AM62x_1.8V-10.2 C_BUCK-1.8V-OUT1.2 C_BUCK-1.8V-OUT2.2 CPU.G7(VDDS_OSC0) CPU.G10(VMON_1P8_SOC) CPU.G16(VDDA_TEMP1) CPU.L11(VDDA_MCU) CPU.L14(VDDA_PLL2) CPU.M4(DDR0_A15_CAS_N) CPU.N3(DDR0_A14_WE_N) CPU.T9(VDDA_TEMP0) CPU.U11(VDDA_PLL0) CPU.U15(VDDA_PLL1) CPU.W9(VDDA_1P8_OLDI0) CPU.W10(VDDA_1P8_OLDI0) CPU.Y11(VDDA_1P8_USB) L_Buck_1.8V.2 R_BUCK-1.8V_Divider-H.2 X_25Mz_AM62x.1(EN) X_25Mz_AM62x.4(VDD)
3.3V: C_AM62x_3.3V-1.2 C_AM62x_3.3V-2.2 C_AM62x_3.3V-3.2 C_AM62x_3.3V-4.2 C_AM62x_3.3V-5.2 C_AM62x_3.3V-6.2 C_AM62x_3.3V-7.2 C_AM62x_3.3V-8.2 C_BUCK-3.3V-OUT1.2 C_BUCK-3.3V-OUT2.2 C_EthernetPHY1-1.2 C_EthernetPHY2-1.1 C_MMC-1.2 Connector_3.3V_Aux-1.1(Pin) Connector_3.3V_Aux-2.1(Pin) Connector_MicroSD.4(VDD) CPU.E11(MCU_RESETZ) CPU.F11(VDDSHV_MCU) CPU.F15(VDDSHV0) CPU.F20(RESET_REQZ) CPU.G12(VDDSHV_MCU) CPU.G14(VDDSHV0) CPU.H9(VDDSHV_CANUART) CPU.J18(VDDSHV6) CPU.K10(VMON_3P3_SOC) CPU.L18(VDDSHV1) CPU.M19(VDDSHV1) CPU.N18(VDDSHV3) CPU.P18(VDDSHV3) CPU.T7(VDDSHV4) CPU.T19(VDDSHV3) CPU.U18(VDDSHV3) CPU.W16(VDDSHV2) CPU.W19(VDDSHV2) CPU.Y13(VDDA_3P3_USB) EthernetPHY2.3(INTR/PWRDN) EthernetPHY2.6(VDDA3V3) EthernetPHY2.19(VDDIO) EthernetPHY_1.3(INTR/PWRDN) EthernetPHY_1.6(VDDA3V3) EthernetPHY_1.19(VDDIO) L_Buck_3.3V.2 LED_3.3V.1 MDIO_Pullup.1 R_BootStrap_Up_0.2 R_BootStrap_Up_1.2 R_BootStrap_Up_2.2 R_BootStrap_Up_3.2 R_BootStrap_Up_4.2 R_BootStrap_Up_5.2 R_BootStrap_Up_6.2 R_BootStrap_Up_7.2 R_BootStrap_Up_8.2 R_BootStrap_Up_9.2 R_BUCK-0.85V_PG.2 R_BUCK-3.3V_Divider-H.2 R_LDO-3.3V-SD_Pullup.2 RMII2_Strap_Address_1.2
5V: BUCK_0.85V.3(VIN) BUCK_1.1V.3(VIN) BUCK_1.8V.3(VIN) BUCK_3.3V.3(VIN) C_Backup-1.2 C_Backup-2.2 C_Backup-3.2 C_Backup-4.2 C_Backup-5.2 C_Backup-6.2 C_Backup-7.2 C_Backup-8.2 C_Backup-9.2 C_Backup-10.2 C_Backup-11.2 C_Backup-12.2 C_BUCK-0.85V-IN.2 C_BUCK-1.1V-IN.2 C_BUCK-1.8V-IN.2 C_BUCK-3.3V-IN.2 C_LDO_SDV-IN.1 Connector_5V-1.1(Pin) Connector_5V-2.1(Pin) Connector_5V-3.1(Pin) Connector_5V-4.1(Pin) Connector_JTAG_5V.1(Pin) Connector_USB.1 Connector_USB.5 LDO_1.8V-SD.1(IN) LDO_3.3V-SD.1(IN) LED_5V.1 R_BUCK-1.1V_PG.2 R_BUCK-1.8V_PG.2 R_BUCK-3.3V_EN.2 R_BUCK-3.3V_PG.2
EARTH: C_EthernetPHY_Earth.1 Connector_RJ451.8(CHS_GND) Connector_RJ451.SH(Shield) Connector_RJ452.8(CHS_GND) Connector_RJ452.SH(Shield) Connector_USB.SH R_EthernetPHY_Earth.1
GND: BUCK_0.85V.1(GND) BUCK_1.1V.1(GND) BUCK_1.8V.1(GND) BUCK_3.3V.1(GND) Button.2 C_1.8V_Crystal.1 C_AM62x_0.85V-1.1 C_AM62x_0.85V-2.1 C_AM62x_0.85V-3.1 C_AM62x_0.85V-4.1 C_AM62x_0.85V-5.1 C_AM62x_0.85V-6.1 C_AM62x_0.85V-7.1 C_AM62x_0.85V-8.1 C_AM62x_0.85V-9.1 C_AM62x_0.85V-10.1 C_AM62x_0.85V-11.1 C_AM62x_0.85V-12.1 C_AM62x_0.85V-13.1 C_AM62x_0.85V-14.1 C_AM62x_1.1V-1.1 C_AM62x_1.1V-2.1 C_AM62x_1.1V-3.1 C_AM62x_1.1V-4.1 C_AM62x_1.1V-5.1 C_AM62x_1.1V-6.1 C_AM62x_1.1V-7.1 C_AM62x_1.8V-1.1 C_AM62x_1.8V-2.1 C_AM62x_1.8V-3.1 C_AM62x_1.8V-4.1 C_AM62x_1.8V-5.1 C_AM62x_1.8V-10.1 C_AM62x_3.3V-1.1 C_AM62x_3.3V-2.1 C_AM62x_3.3V-3.1 C_AM62x_3.3V-4.1 C_AM62x_3.3V-5.1 C_AM62x_3.3V-6.1 C_AM62x_3.3V-7.1 C_AM62x_3.3V-8.1 C_AM62x_SDV_0.1uF.1 C_AM62x_SDV_1uF.1 C_AM62x_SDV_10uF.1 C_Backup-1.1 C_Backup-2.1 C_Backup-3.1 C_Backup-4.1 C_Backup-5.1 C_Backup-6.1 C_Backup-7.1 C_Backup-8.1 C_Backup-9.1 C_Backup-10.1 C_Backup-11.1 C_Backup-12.1 C_BUCK-0.85V-IN.1 C_BUCK-0.85V-OUT1.1 C_BUCK-0.85V-OUT2.1 C_BUCK-1.1V-IN.1 C_BUCK-1.1V-OUT1.1 C_BUCK-1.1V-OUT2.1 C_BUCK-1.8V-IN.1 C_BUCK-1.8V-OUT1.1 C_BUCK-1.8V-OUT2.1 C_BUCK-3.3V-IN.1 C_BUCK-3.3V-OUT1.1 C_BUCK-3.3V-OUT2.1 C_CAP_SOC_MCU.2 C_CAP_SOC_VDDS0.2 C_CAP_SOC_VDDS1.2 C_CAP_SOC_VDDS2.2 C_CAP_SOC_VDDS3.2 C_CAP_SOC_VDDS4.2 C_CAP_SOC_VDDS5.2 C_CAP_SOC_VDDS6.2 C_CAP_SOC_VDDS_CANUART.2 C_EthernetPHY1-1.1 C_EthernetPHY2-1.2 C_EthernetPHY_Earth.2 C_LDO_SDV-IN.2 C_MMC-1.1 C_RJ451_RD1.1 C_RJ451_TD1.1 C_RJ452_RD1.1 C_RJ452_TD1.1 Connector_GND1.1(Pin) Connector_GND2.1(Pin) Connector_GND3.1(Pin) Connector_GND4.1(Pin) Connector_GND5.1(Pin) Connector_GND6.1(Pin) Connector_GND7.1(Pin) Connector_GND8.1(Pin) Connector_GND9.1(Pin) Connector_GND11.1(Pin) Connector_GND12.1(Pin) Connector_GND13.1(Pin) Connector_GND14.1(Pin) Connector_GND15.1(Pin) Connector_GND16.1(Pin) Connector_GND17.1(Pin) Connector_GND18.1(Pin) Connector_GND19.1(Pin) Connector_GND20.1(Pin) Connector_JTAG_GND-1.1(Pin) Connector_JTAG_GND-2.1(Pin) Connector_MicroSD.6(VSS) Connector_MicroSD.SH Connector_RJ451.10(LED_G-) Connector_RJ451.11(LED_Y-) Connector_RJ452.10(LED_G-) Connector_RJ452.11(LED_Y-) Connector_USB.4 Connector_USB.8 CPU.A1(VSS) CPU.A3(MCU_OSC0_XO) CPU.A23(MMC2_SDCD) CPU.A24(VSS) CPU.A25(VSS) CPU.AA11(VSS) CPU.AB9(VSS) CPU.AC20(RGMII2_TD3) CPU.AD1(VSS) CPU.AD9(VSS) CPU.AD12(VSS) CPU.AD16(VSS) CPU.AD22(RGMII2_RTL) CPU.AD25(VSS) CPU.AE1(VSS) CPU.AE8(VSS) CPU.AE12(VSS) CPU.AE16(VSS) CPU.AE24(VSS) CPU.AE25(VSS) CPU.B25(VSS) CPU.C2(WKUP_LFOSC0_XI) CPU.E1(DDR0_DQS0) CPU.E2(DDR0_DQS0_N) CPU.E3(DDR0_DQ4) CPU.F1(DDR0_DQ7) CPU.F3(DDR0_DQ2) CPU.F4(DDR0_DQ0) CPU.F13(VSS) CPU.G1(DDR0_RESET0_N) CPU.G5(DDR0_DQ1) CPU.G13(VSS) CPU.G19(VSS) CPU.H5(DDR0_DM0) CPU.H6(DDR0_DQ3) CPU.H10(VMON_VSYS) CPU.H13(VSS) CPU.H16(VSS) CPU.H18(VSS) CPU.H20(VSS) CPU.J1(DDR0_A0) CPU.J2(DDR0_A1) CPU.J3(DDR0_ODT1) CPU.J4(DDR0_CKE1) CPU.J7(VSS) CPU.J13(VSS) CPU.K1(DDR0_A5) CPU.K2(DDR0_CS1_N) CPU.K3(DDR0_A2) CPU.K4(DDR0_A4) CPU.K7(VSS) CPU.K13(VSS) CPU.K15(VSS) CPU.K19(VSS) CPU.L1(DDR0_CK0) CPU.L2(DDR0_CK0_N) CPU.L5(DDR0_A3) CPU.L6(DDR0_CS0_N) CPU.L20(VSS) CPU.M1(DDR0_BA0) CPU.M5(DDR0_A16_RAS_N) CPU.M7(VSS) CPU.M8(VSS) CPU.M10(VSS) CPU.M12(VSS) CPU.M13(VSS) CPU.M17(VSS) CPU.M18(VSS) CPU.N6(DDR0_ACT_N) CPU.N15(VSS) CPU.P1(DDR0_A8) CPU.P4(DDR0_A9) CPU.P5(DDR0_A11) CPU.P7(VSS) CPU.P10(VSS) CPU.P13(VSS) CPU.R1(DDR0_A13) CPU.R5(DDR0_A10) CPU.R6(DDR0_A12) CPU.R13(VSS) CPU.R15(VSS) CPU.R18(VSS) CPU.R20(VSS) CPU.T1(DDR0_PAR) CPU.T4(DDR0_BG0) CPU.T8(VSS) CPU.T13(VSS) CPU.T14(VSS) CPU.T16(VSS) CPU.T17(VSS) CPU.T18(VSS) CPU.U3(DDR0_DQ9) CPU.U8(VSS) CPU.U19(VSS) CPU.V1(DDR0_DQS1) CPU.V5(DDR0_DQ11) CPU.V6(DDR0_DQ13) CPU.V9(VSS) CPU.V10(VSS) CPU.V11(VSS) CPU.V13(VSS) CPU.V16(VSS) CPU.V18(VSS) CPU.W1(DDR0_DQ15) CPU.W5(DDR0_DM1) CPU.W7(VSS) CPU.W13(VDDA_CORE_CSIRX0) CPU.W14(VDDA_1P8_CSIRX0) CPU.Y1(DDR0_DQ14) CPU.Y2(VSS) EthernetPHY2.9(GND) EthernetPHY2.21(GND) EthernetPHY2.25(EPAD) EthernetPHY_1.9(GND) EthernetPHY_1.21(GND) EthernetPHY_1.25(EPAD) LDO_1.8V-SD.2(GND) LDO_3.3V-SD.2(GND) MMC_SDCD_Pulldown.1 R_BootStrap_Down_3.1 R_BootStrap_Down_4.1 R_BootStrap_Down_5.1 R_BootStrap_Down_6.1 R_BootStrap_Down_7.1 R_BootStrap_Down_8.1 R_BootStrap_Down_9.1 R_BootStrap_Down_10.1 R_BootStrap_Down_11.1 R_BootStrap_Down_12.1 R_BootStrap_Down_13.1 R_BootStrap_Down_14.1 R_BootStrap_Down_15.1 R_BUCK-0.85V_Divider-L.1 R_BUCK-1.1V_Divider-L.1 R_BUCK-1.8V_Divider-L.1 R_BUCK-3.3V_Divider-L.1 R_DDR0_CAL0.2 R_EthernetPHY_Earth.2 R_JTAG_Pulldown_RST.2 R_LDO-1.8V-SD_Pulldown.2 R_LED0.1 R_LED1.1 R_LED2.1 R_LED3.1 R_LED_3.3V.1 R_LED_5V.1 R_LED_IGBT_UH.1 R_LED_IGBT_UL.1 R_LED_IGBT_VH.1 R_LED_IGBT_VL.1 R_LED_IGBT_WH.1 R_LED_IGBT_WL.1 R_MCU_PORZ.2 R_RBIAS_EthernetPHY1.2 R_RBIAS_EthernetPHY2.2 R_USB0_CAL.1 R_USB1_CAL.1 X_25Mz_AM62x.2(GND)
SDV: C_AM62x_SDV_0.1uF.2 C_AM62x_SDV_1uF.2 C_AM62x_SDV_10uF.2 CPU.G17(VDDSHV5) LDO_1.8V-SD.5(OUT) LDO_3.3V-SD.5(OUT) R_MMC_PULLUP_CMD.1 R_MMC_PULLUP_D0.1 R_MMC_PULLUP_D1.1 R_MMC_PULLUP_D2.1 R_MMC_PULLUP_D3.1
0.85V PG: BUCK_0.85V.6(PG) CPU.D2(MCU_PORZ) EthernetPHY2.5(RST_N) EthernetPHY_1.5(RST_N) R_BUCK-0.85V_PG.1 R_MCU_PORZ.1
1.1V PG: BUCK_0.85V.4(EN) BUCK_1.1V.6(PG) R_BUCK-1.1V_PG.1
1.8V PG: BUCK_1.1V.4(EN) BUCK_1.8V.6(PG) R_BUCK-1.8V_PG.1
3.3V PG: BUCK_1.8V.4(EN) BUCK_3.3V.6(PG) R_BUCK-3.3V_PG.1
25Mhz: CPU.B2(MCU_OSC0_XI) X_25Mz_AM62x.3(OUT)
Buck 0.85V Feedback: BUCK_0.85V.5(FB) R_BUCK-0.85V_Divider-H.1 R_BUCK-0.85V_Divider-L.2
Buck 0.85V Inductor: BUCK_0.85V.2(SW) L_Buck_0.85V.1
Buck 1.1V Feedback: BUCK_1.1V.5(FB) R_BUCK-1.1V_Divider-H.1 R_BUCK-1.1V_Divider-L.2
Buck 1.1V Inductor: BUCK_1.1V.2(SW) L_Buck_1.1V.1
Buck 1.8V Feedback: BUCK_1.8V.5(FB) R_BUCK-1.8V_Divider-H.1 R_BUCK-1.8V_Divider-L.2
Buck 1.8V Inductor: BUCK_1.8V.2(SW) L_Buck_1.8V.1
Buck 3.3V Feedback: BUCK_3.3V.5(FB) R_BUCK-3.3V_Divider-H.1 R_BUCK-3.3V_Divider-L.2
Buck 3.3V Inductor: BUCK_3.3V.2(SW) L_Buck_3.3V.1
CAP_SOC CANUART: C_CAP_SOC_VDDS_CANUART.1 CPU.G9(CAP_VDDS_CANUART)
CAP_SOC MCU: C_CAP_SOC_MCU.1 CPU.H11(CAP_VDDS_MCU)
CAP_SOC VDDS0: C_CAP_SOC_VDDS0.1 CPU.H15(CAP_VDDS0)
CAP_SOC VDDS1: C_CAP_SOC_VDDS1.1 CPU.K18(CAP_VDDS1)
CAP_SOC VDDS2: C_CAP_SOC_VDDS2.1 CPU.W17(CAP_VDDS2)
CAP_SOC VDDS3: C_CAP_SOC_VDDS3.1 CPU.P19(CAP_VDDS3)
CAP_SOC VDDS4: C_CAP_SOC_VDDS4.1 CPU.U7(CAP_VDDS4)
CAP_SOC VDDS5: C_CAP_SOC_VDDS5.1 CPU.H17(CAP_VDDS5)
CAP_SOC VDDS6: C_CAP_SOC_VDDS6.1 CPU.J19(CAP_VDDS6)
DDR0_CAL: CPU.M2(DDR0_CAL0) R_DDR0_CAL0.1
DDR_ZQ: CPU.R3(DDR0_ALERT_N) R_DDRZQ.1
Enable: BUCK_3.3V.4(EN) Button.1 R_BUCK-3.3V_EN.1
Error: CPU.D1(MCU_ERRORN)
Ethernet1 RD_N: Connector_RJ451.6(RD-) EthernetPHY_1.7(RD-)
Ethernet1 RD_P: Connector_RJ451.3(RD+) EthernetPHY_1.8(RD+)
Ethernet1 TD_N: Connector_RJ451.2(TD-) EthernetPHY_1.10(TD-)
Ethernet1 TD_P: Connector_RJ451.1(TD+) EthernetPHY_1.11(TD+)
Ethernet2 RD_N: Connector_RJ452.6(RD-) EthernetPHY2.7(RD-)
Ethernet2 RD_P: Connector_RJ452.3(RD+) EthernetPHY2.8(RD+)
Ethernet2 TD_N: Connector_RJ452.2(TD-) EthernetPHY2.10(TD-)
Ethernet2 TD_P: Connector_RJ452.1(TD+) EthernetPHY2.11(TD+)
EthernetPHY1 LED Act: EthernetPHY_1.4(LED0) R_EthernetPHY1_LED_Act.2
EthernetPHY1 RBIAS: EthernetPHY_1.14(RBIAS) R_RBIAS_EthernetPHY1.1
EthernetPHY2 LED Act: EthernetPHY2.4(LED0) R_EthernetPHY2_LED_Act.2
EthernetPHY2 RBIAS: EthernetPHY2.14(RBIAS) R_RBIAS_EthernetPHY2.1
I2C0 SCL: Connector_I2C0_SCL.1(Pin) CPU.B16(I2C0_SCL)
I2C0 SDA: Connector_I2C0_SDA.1(Pin) CPU.A16(I2C0_SDA)
I2C1 SCL: Connector_I2C1_SCL.1(Pin) CPU.B17(I2C1_SCL)
I2C1 SDA: Connector_I2C1_SDA.1(Pin) CPU.A17(I2C1_SDA)
I2C2 SCL: Connector_I2C2_SDA.1(Pin) CPU.K24(GPMC0_CS3_N)
IGBT UH: Connector_IGBT_UH.1(Pin) CPU.AB2(MMC0_DAT4) LED_IGBT_UH.1
IGBT UH*: LED_IGBT_UH.2 R_LED_IGBT_UH.2
IGBT UL: Connector_IGBT_UL.1(Pin) CPU.Y4(MMC0_DAT3) LED_IGBT_UL.1
IGBT UL*: LED_IGBT_UL.2 R_LED_IGBT_UL.2
IGBT VH: Connector_IGBT_VH.1(Pin) CPU.AA3(MMC0_DAT2) LED_IGBT_VH.1
IGBT VH*: LED_IGBT_VH.2 R_LED_IGBT_VH.2
IGBT VL: Connector_IGBT_VL.1(Pin) CPU.AA1(MMC0_DAT1) LED_IGBT_VL.1
IGBT VL*: LED_IGBT_VL.2 R_LED_IGBT_VL.2
IGBT WH: Connector_IGBT_WH.1(Pin) CPU.AB1(MMC0_CLK) LED_IGBT_WH.1
IGBT WH*: LED_IGBT_WH.2 R_LED_IGBT_WH.2
IGBT WL: Connector_IGBT_WL.1(Pin) CPU.Y3(MMC0_CMD) LED_IGBT_WL.1
IGBT WL*: LED_IGBT_WL.2 R_LED_IGBT_WL.2
Input 0: Connector_PRU0_GPIO0.1(Pin) CPU.M25(PRG0_PRU0_GPIO0) R_BootStrap_Up_0.1
Input 1: Connector_PRU0_GPIO1.1(Pin) CPU.N23(PRG0_PRU0_GPIO1) R_BootStrap_Up_1.1
Input 2: Connector_PRU0_GPIO2.1(Pin) CPU.N24(PRG0_PRU0_GPIO2) R_BootStrap_Up_2.1
Input 3: Connector_PRU0_GPIO3.1(Pin) CPU.N25(PRG0_PRU0_GPIO3) R_BootStrap_Down_3.2 R_BootStrap_Up_3.1
Input 4: Connector_PRU0_GPIO4.1(Pin) CPU.P24(PRG0_PRU0_GPIO4) R_BootStrap_Down_4.2 R_BootStrap_Up_4.1
Input 5: Connector_PRU0_GPIO5.1(Pin) CPU.P22(PRG0_PRU0_GPIO5) R_BootStrap_Down_5.2 R_BootStrap_Up_5.1
Input 6: Connector_PRU0_GPIO6.1(Pin) CPU.P21(PRG0_PRU0_GPIO6) R_BootStrap_Down_6.2 R_BootStrap_Up_6.1
Input 7: Connector_PRU0_GPIO7.1(Pin) CPU.R23(PRG0_PRU0_GPIO7) R_BootStrap_Down_7.2 R_BootStrap_Up_7.1
Input 8: Connector_PRU0_GPIO8.1(Pin) CPU.P25(PRG0_PRU0_GPIO8)
Input 9: Connector_PRU0_GPIO9.1(Pin) CPU.L23(PRG0_PRU0_GPIO9)
Input 10: Connector_PRU0_GPIO10.1(Pin) CPU.L24(PRG0_PRU0_GPIO10)
Input 11: Connector_PRU0_GPIO11.1(Pin) CPU.L25(PRG0_PRU0_GPIO11)
Input 12: Connector_PRU0_GPIO12.1(Pin) CPU.M24(PRG0_PRU0_GPIO12)
Input 13: Connector_PRU0_GPIO13.1(Pin) CPU.N20(PRG0_PRU0_GPIO13)
Input 14: Connector_PRU0_GPIO14.1(Pin) CPU.U23(PRG0_PRU0_GPIO14)
Input 15: Connector_PRU0_GPIO15.1(Pin) CPU.K25(PRG0_PRU0_GPIO15)
Input 16: Connector_PRU0_GPIO16.1(Pin) CPU.M22(PRG0_PRU0_GPIO16)
Input 17: Connector_PRU0_GPIO17.1(Pin) CPU.M21(PRG0_PRU0_GPIO17)
Input 18: Connector_PRU0_GPIO18.1(Pin) CPU.L21(PRG0_PRU0_GPIO18)
Input 19/I2C2 SDA: Connector_PRU0_GPIO19.1(Pin) CPU.K22(PRG0_PRU0_GPIO19)
JTAG RST: Connector_JTAG_RST.1(Pin) CPU.B10(TRST_N) R_JTAG_Pulldown_RST.1
JTAG TCK: Connector_JTAG_TCK.1(Pin) CPU.A10(TCK)
JTAG TDI: Connector_JTAG_TDI.1(Pin) CPU.A11(TDI)
JTAG TDO: Connector_JTAG_TDO.1(Pin) R_JTAG_TDO.2
JTAG TDO*: CPU.D12(TDO) R_JTAG_TDO.1
JTAG TMS: Connector_JTAG_TMS.1(Pin) CPU.B11(TMS)
LED0: CPU.AC2(MMC0_DAT7) LED0.1
LED0*: LED0.2 R_LED0.2
LED1: CPU.AD2(MMC0_DAT6) LED1.1
LED1*: LED1.2 R_LED1.2
LED2: CPU.AC1(MMC0_DAT5) LED2.1
LED2*: LED2.2 R_LED2.2
LED3: CPU.AA2(MMC0_DAT0) LED3.1
LED3*: LED3.2 R_LED3.2
LED 3.3V: LED_3.3V.2 R_LED_3.3V.2
LED 5V: LED_5V.2 R_LED_5V.2
MCAN RX: Connector_MCAN_RX.1(Pin) CPU.E15(MCAN0_RX)
MCAN TX: Connector_MCAN_TX.1(Pin) CPU.C15(MCAN0_TX)
MCU I2C SCL: Connector_MCU_I2C_SCL.1(Pin) CPU.A8(MCU_I2C0_SCL)
MCU I2C SDA: Connector_MCU_I2C_SDA.1(Pin) CPU.D10(MCU_I2C0_SDA)
MCU MCAN0 RX: Connector_MCU_MCAN0_RX.1(Pin) CPU.B3(MCU_MCAN0_RX)
MCU MCAN0 TX: Connector_MCU_MCAN0_TX.1(Pin) CPU.D6(MCU_MCAN0_TX)
MCU MCAN1 RX: Connector_MCU_MCAN1_RX.1(Pin) CPU.D4(MCU_MCAN1_RX)
MCU MCAN1 TX: Connector_MCU_MCAN1_TX.1(Pin) CPU.E5(MCU_MCAN1_TX)
MCU RESETSTATZ: Connector_MCU_RESETSTATZ.1(Pin) CPU.B12(MCU_RESETSTATZ)
MCU SPI CLK: Connector_MCU_SPI_CLK.1(Pin) CPU.A7(MCU_SPI0_CLK)
MCU SPI CS0: Connector_MCU_SPI_CS0.1(Pin) CPU.E8(MCU_SPI0_CS0)
MCU SPI CS1: Connector_MCU_SPI_CS1.1(Pin) CPU.B8(MCU_SPI0_CS1)
MCU SPI D0: Connector_MCU_SPI_D0.1(Pin) CPU.D9(MCU_SPI0_D0)
MCU SPI D1: Connector_MCU_SPI_D1.1(Pin) CPU.C9(MCU_SPI0_D1)
MCU UART CTS: Connector_MCU_UART_CTS.1(Pin) CPU.A6(MCU_UART0_CTS_N)
MCU UART RTS: Connector_MCU_UART_RTS.1(Pin) CPU.B6(MCU_UART0_RTS_N)
MCU UART RX: Connector_MCU_UART_RX.1(Pin) CPU.B5(MCU_UART0_RXD)
MCU UART TX: Connector_MCU_UART_TX.1(Pin) CPU.A5(MCU_UART0_TXD)
MDC: CPU.AD24(MDIO0_MDC) EthernetPHY2.16(MDC) EthernetPHY_1.16(MDC)
MDIO: CPU.AB22(MDIO0_MDIO) EthernetPHY2.15(MDIO) EthernetPHY_1.15(MDIO) MDIO_Pullup.2
MMC_CLK: Connector_MicroSD.3(CMD) CPU.B22(MMC1_CLK)
MMC_CMD: Connector_MicroSD.5(CLK) CPU.A21(MMC1_CMD) R_MMC_PULLUP_CMD.2
MMC_D0: Connector_MicroSD.7(DAT0) CPU.A22(MMC1_DAT0) R_MMC_PULLUP_D0.2
MMC_D1: Connector_MicroSD.8(DAT1) CPU.B21(MMC1_DAT1) R_MMC_PULLUP_D1.2
MMC_D2: Connector_MicroSD.1(DAT2) CPU.C21(MMC1_DAT2) R_MMC_PULLUP_D2.2
MMC_D3: Connector_MicroSD.2(DAT3/CD) CPU.D22(MMC1_DAT3) R_MMC_PULLUP_D3.2
Output 0: Connector_PRU1_GPIO0.1(Pin) CPU.U22(PRG0_PRU1_GPIO0)
Output 1: Connector_PRU1_GPIO1.1(Pin) CPU.V24(PRG0_PRU1_GPIO1)
Output 2: Connector_PRU1_GPIO2.1(Pin) CPU.W25(PRG0_PRU1_GPIO2)
Output 3: Connector_PRU1_GPIO3.1(Pin) CPU.W24(PRG0_PRU1_GPIO3)
Output 4: Connector_PRU1_GPIO4.1(Pin) CPU.Y25(PRG0_PRU1_GPIO4)
Output 5: Connector_PRU1_GPIO5.1(Pin) CPU.Y24(PRG0_PRU1_GPIO5)
Output 6: Connector_PRU1_GPIO6.1(Pin) CPU.Y23(PRG0_PRU1_GPIO6)
Output 7: Connector_PRU1_GPIO7.1(Pin) CPU.AA25(PRG0_PRU1_GPIO7)
Output 8: Connector_PRU1_GPIO8.1(Pin) CPU.W21(PRG0_PRU1_GPIO8)
Output 9: Connector_PRU1_GPIO9.1(Pin) CPU.V20(PRG0_PRU1_GPIO9)
Output 10: Connector_PRU1_GPIO10.1(Pin) CPU.AA23(PRG0_PRU1_GPIO10)
Output 11: Connector_PRU1_GPIO11.1(Pin) CPU.AB25(PRG0_PRU1_GPIO11)
Output 12: Connector_PRU1_GPIO12.1(Pin) CPU.AA24(PRG0_PRU1_GPIO12)
Output 13: Connector_PRU1_GPIO13.1(Pin) CPU.Y22(PRG0_PRU1_GPIO13)
Output 14: Connector_PRU1_GPIO14.1(Pin) CPU.AA21(PRG0_PRU1_GPIO14)
Output 15: Connector_PRU1_GPIO15.1(Pin) CPU.AB24(PRG0_PRU1_GPIO15)
Output 16: Connector_PRU1_GPIO16.1(Pin) CPU.V21(PRG0_PRU1_GPIO16)
Output 17: Connector_PRU1_GPIO17.1(Pin) CPU.Y20(PRG0_PRU1_GPIO17)
Output 18: Connector_PRU1_GPIO18.1(Pin) CPU.AC25(PRG0_PRU1_GPIO1~{8})
Output 19: Connector_PRU1_GPIO19.1(Pin) CPU.AC24(PRG0_PRU1_GPIO19)
R5F CLOCKOUT: Connector_R5F_CLOCKOUT.1(Pin) CPU.A12(WKUP_CLKOUT0)
R5F I2C SCL: Connector_R5F_I2C_SCL.1(Pin) CPU.B9(WKUP_I2C0_SCL)
R5F I2C SDA: Connector_R5F_I2C_SDA.1(Pin) CPU.A9(WKUP_I2C0_SDA)
R5F UART CTS: Connector_R5F_UART_CTS.1(Pin) CPU.A4(WKUP_UART0_RTS_N)
R5F UART RTS: Connector_R5F_UART_RTS.1(Pin) CPU.C6(WKUP_UART0_CTS_N)
R5F UART RX: Connector_R5F_UART_RX.1(Pin) CPU.B4(WKUP_UART0_RXD)
R5F UART TX: Connector_R5F_UART_TX.1(Pin) CPU.C5(WKUP_UART0_TXD)
RJ451 LED_Y+: Connector_RJ451.12(LED_Y+) R_EthernetPHY1_LED_Act.1
RJ451 RD~: C_RJ451_RD1.2 Connector_RJ451.5(RD~)
RJ451 TD~: C_RJ451_TD1.2 Connector_RJ451.4(TD~)
RJ452 LED_Y+: Connector_RJ452.12(LED_Y+) R_EthernetPHY2_LED_Act.1
RJ452 RD~: C_RJ452_RD1.2 Connector_RJ452.5(RD~)
RJ452 TD~: C_RJ452_TD1.2 Connector_RJ452.4(TD~)
RMII1 CLK: CPU.AD17(RGMII1_RXC) EthernetPHY_1.2(50MHZOUT)
RMII1 CRS_DV: CPU.AE19(RGMII1_TXC) EthernetPHY_1.20(CRS_DV)
RMII1 LED: CPU.AA15(RGMII1_RD3) R_EthernetPHY1_LED_USER.1
RMII1 LED*: Connector_RJ451.9(LED_G+) R_EthernetPHY1_LED_USER.2
RMII1 RX_D0: CPU.AB17(RGMII1_RD0) EthernetPHY_1.18(RX_D0)
RMII1 RX_D1: CPU.AC17(RGMII1_RD1) EthernetPHY_1.17(RX_D1)
RMII1 TX_D0: CPU.AE20(RGMII1_TD0) EthernetPHY_1.23(TX_D0)
RMII1 TX_D1: CPU.AD20(RGMII1_TD1) EthernetPHY_1.24(TX_D1)
RMII1 TX_EN: CPU.AD19(RGMII1_TTL) EthernetPHY_1.1(TX_EN)
RMII2 CLK: CPU.AD23(RGMII2_RXC) EthernetPHY2.2(50MHZOUT)
RMII2 CRS_DV: CPU.AE21(RGMII2_TXC) EthernetPHY2.20(CRS_DV) RMII2_Strap_Address_1.1
RMII2 LED: CPU.AB16(RGMII1_RD2) R_EthernetPHY2_LED_USER.1
RMII2 LED*: Connector_RJ452.9(LED_G+) R_EthernetPHY2_LED_USER.2
RMII2 RX_D0: CPU.AE23(RGMII2_RD0) EthernetPHY2.18(RX_D0)
RMII2 RX_D1: CPU.AB20(RGMII2_RD1) EthernetPHY2.17(RX_D1)
RMII2 TX_D0: CPU.Y18(RGMII2_TD0) EthernetPHY2.23(TX_D0)
RMII2 TX_D1: CPU.AA18(RGMII2_TD1) EthernetPHY2.24(TX_D1)
RMII2 TX_EN: CPU.AA19(RGMII2_TTL) EthernetPHY2.1(TX_EN)
RMIICLK: CPU.A18(EXT_REFCLK1) EthernetPHY2.13(XI) EthernetPHY_1.13(XI)
SD 1.8V Enable: CPU.F23(OSPI0_CS0_N) LDO_1.8V-SD.3(EN) R_LDO-1.8V-SD_Pulldown.1
SD 3.3V Enable: CPU.E23(MMC2_DAT2) LDO_3.3V-SD.3(EN) R_LDO-3.3V-SD_Pullup.1
SPI CLK: Connector_SPL_CLK.1(Pin) CPU.A14(SPI0_CLK)
SPI CS0: Connector_SPI_CS0.1(Pin) CPU.A13(SPI0_CS0)
SPI CS1: Connector_SPI_CS1.1(Pin) CPU.C13(SPI0_CS1)
SPI D0: Connector_SPI_D0.1(Pin) CPU.B13(SPI0_D0)
SPI D1: Connector_SPI_D1.1(Pin) CPU.B14(SPI0_D1)
Status: CPU.F22(RESETSTATZ)
UART0 FL: Connector_UART0_FL.1(Pin) CPU.B15(I2C3_SDA)
UART0 RX: Connector_JTAG_UART_RX.1(Pin) Connector_UART0_RX.1(Pin) CPU.D14(UART0_RX)
UART0 TX: Connector_JTAG_TX.1(Pin) Connector_UART0_TX.1(Pin) CPU.E14(UART0_TX)
UART1 FL: Connector_UART1_FL.1(Pin) CPU.A19(MCASP0_AXR2)
UART1 RX: Connector_UART1_RX.1(Pin) CPU.E19(UART1_RX)
UART1 TX: Connector_UART1_TX.1(Pin) CPU.A20(UART1_TX)
UART2 RX: Connector_UART2_RX.1(Pin) CPU.R24(UART2_RX) R_BootStrap_Down_8.2 R_BootStrap_Up_8.1
UART2 TX: Connector_UART2_TX.1(Pin) CPU.R25(UART2_TX) R_BootStrap_Down_9.2 R_BootStrap_Up_9.1
UART3 RX: Connector_UART3_RX.1(Pin) CPU.T25(UART3_RX) R_BootStrap_Down_10.2
UART3 TX: Connector_UART3_TX.1(Pin) CPU.R21(UART3_TX) R_BootStrap_Down_11.2
UART4 RX: Connector_UART4_RX.1(Pin) CPU.T22(UART4_RX) R_BootStrap_Down_12.2
UART4 TX: Connector_UART4_TX.1(Pin) CPU.T24(UART4_TX) R_BootStrap_Down_13.2
UART5 RX: Connector_UART5_RX.1(Pin) CPU.U25(UART5_RX) R_BootStrap_Down_14.2
UART5 TX: Connector_UART5_TX.1(Pin) CPU.U24(UART5_TX) R_BootStrap_Down_15.2
UART6 RX: Connector_UART6_RX.1(Pin) CPU.D17(UART6_RX) MMC_SDCD_Pulldown.2
UART6 TX: Connector_UART6_TX.1(Pin) CPU.C17(UART6_TX)
USB0 D_N: Connector_USB.6 CPU.AE11(USB0_DM)
USB0 D_P: Connector_USB.7 CPU.AD11(USB0_DP)
USB0 RCAL: CPU.AE10(USB0_RCALIB) R_USB0_CAL.2
USB1 D_N: Connector_USB.2 CPU.AD10(USB1_DM)
USB1 D_P: Connector_USB.3 CPU.AE9(USB1_DP)
USB1 RCAL: CPU.AC9(USB1_RCALIB) R_USB1_CAL.2

Not connected (* = marked no-connect by the designer): Connector_MicroSD 9(CD-1) 10(CD-2); Connector_RJ451 7(NC); Connector_RJ452 7(NC); CPU A2(RSVD1) A15(I2C3_SCL) AA5(OLDI0_A0N) AA7(OLDI0_A3P) AA8(OLDI0_A2P) AA12(RSVD6) AA14(CSI0_RXRCALIB) AB4(OLDI0_A1P) AB6(OLDI0_A3N) AB10(USB1_VBUS) AB12(CSI0_RXN3) AB14(CSI0_RXN0) AC5(OLDI0_A4P) AC6(OLDI0_A4N) AC11(USB0_VBUS) AC13(CSI0_RXP3) AC15(CSI0_RXP0) AC21(RGMII2_RD2)* AD3(OLDI0_A1N) AD4(OLDI0_CLK0N) AD5(OLDI0_CLK1P) AD6(OLDI0_A5P) AD7(OLDI0_A6P) AD8(OLDI0_A7N) AD13(CSI0_RXN2) AD14(CSI0_RXN1) AD15(CSI0_RXCLKN) AD18(RGMII1_TD3)* AD21(RGMII2_TD2)* AE2(RSVD3) AE3(OLDI0_CLK0P) AE4(OLDI0_CLK1N) AE5(OLDI0_A5N) AE6(OLDI0_A6N) AE7(OLDI0_A7P) AE13(CSI0_RXP2) AE14(CSI0_RXP1) AE15(CSI0_RXCLKP) AE17(RGMII1_RTL)* AE18(RGMII1_TD2)* AE22(RGMII2_RD3)* B1(RSVD0) B7(PMIC_LPM_EN0) B18(MCASP0_AXR1) B19(MCASP0_AXR3) B20(MCASP0_ACLKX) B23(MMC2_SDWP) B24(MMC2_DAT0) C1(WKUP_LFOSC0_XO)* C11(EMU1) C20(USB0_DRVVBUS) C24(MMC2_CMD) C25(MMC2_DAT1) D16(EXTINTN) D20(MCASP0_AFSX) D24(MMC2_DAT3) D25(MMC2_CLK) E7(RSVD8) E12(EMU0) E18(MCASP0_AXR0) E21(PORZ_OUT) E24(OSPI0_CS3_N) E25(OSPI0_D0) F6(RSVD2) F18(USB1_DRVVBUS) F24(OSPI0_D3) F25(OSPI0_D2) G21(OSPI0_CS1_N) G24(OSPI0_D1) G25(OSPI0_LBCLKO) H21(OSPI0_CS2_N) H24(OSPI0_CLK) H25(OSPI0_D6) J8(VPP) J22(OSPI0_D7) J23(OSPI0_D4) J24(OSPI0_DQS) J25(OSPI0_D5) T2(RSVD4) U4(RSVD5) V25(GPMC0_WAIT1) Y6(OLDI0_A0P) Y8(OLDI0_A2N) Y15(RSVD7); EthernetPHY2 12(XO)* 22(RX_ER)*; EthernetPHY_1 12(XO)* 22(RX_ER)*; LDO_1.8V-SD 4(NC); LDO_3.3V-SD 4(NC)

## Layout directives
net class MMC: MMC_CLK, MMC_CMD, MMC_D0, MMC_D1, MMC_D2, MMC_D3
differential pair; differential pair class MDI1: Ethernet1 RD_N, Ethernet1 RD_P, Ethernet1 TD_N, Ethernet1 TD_P
differential pair; differential pair class MDI2: Ethernet2 RD_N, Ethernet2 RD_P, Ethernet2 TD_N, Ethernet2 TD_P
differential pair; differential pair class USB0: USB0 D_N, USB0 D_P
differential pair; differential pair class USB1: USB1 D_N, USB1 D_P
net class RMII1 RX: RMII1 CLK, RMII1 CRS_DV, RMII1 RX_D0, RMII1 RX_D1
net class RMII1 TX: RMII1 CLK, RMII1 TX_D0, RMII1 TX_D1, RMII1 TX_EN
net class RMII2 RX: RMII2 CLK, RMII2 CRS_DV, RMII2 RX_D0, RMII2 RX_D1
net class RMII2 TX: RMII2 CLK, RMII2 TX_D0, RMII2 TX_D1, RMII2 TX_EN

## Notes on the sheet
- Input Supply
- BootStrap
- 10A 50W
- (near BUCK_3.3V) 3A 9.9W
- (near BUCK_1.8V) 3A 5.4W
- (near BUCK_1.1V) 3A 3.3W
- (near BUCK_0.85V) 3A 2.55W
- (near LDO_3.3V-SD) 0.3A 0.99W
- 0
- 1
- 2
- 3
- 4
- 5
- 6
- 7
- 8
- (near R_BootStrap_Up_9) 9
- (near R_BootStrap_Up_9) 10
- 11
- 12
- 13
- 14
- 15
- (near R_BootStrap_Up_6) SSD
- (near R_BootStrap_Up_9) SSD
- SOC
- (near R_BootStrap_Down_3) SSD
- (near R_BootStrap_Down_4) SSD
- (near R_BootStrap_Down_5) SSD
- (near R_BootStrap_Down_7) SSD
- (near R_BootStrap_Down_8) SSD
- LEDs
- SD Card
- 0.200A
- Ethernet
- (near C_EthernetPHY1-1) 0.064A
- (near C_EthernetPHY2-1) 0.064A
- (near Connector_USB) USB
- (near C_1.8V_Crystal) 0.0075A
- (in symbol Button) PB
- (in symbol CPU AM6254) DDR 1.1V; DDR 1.8V; SIP Pins; DDR_ZQ